# Altium project Power Distribution Board.PrjPcb
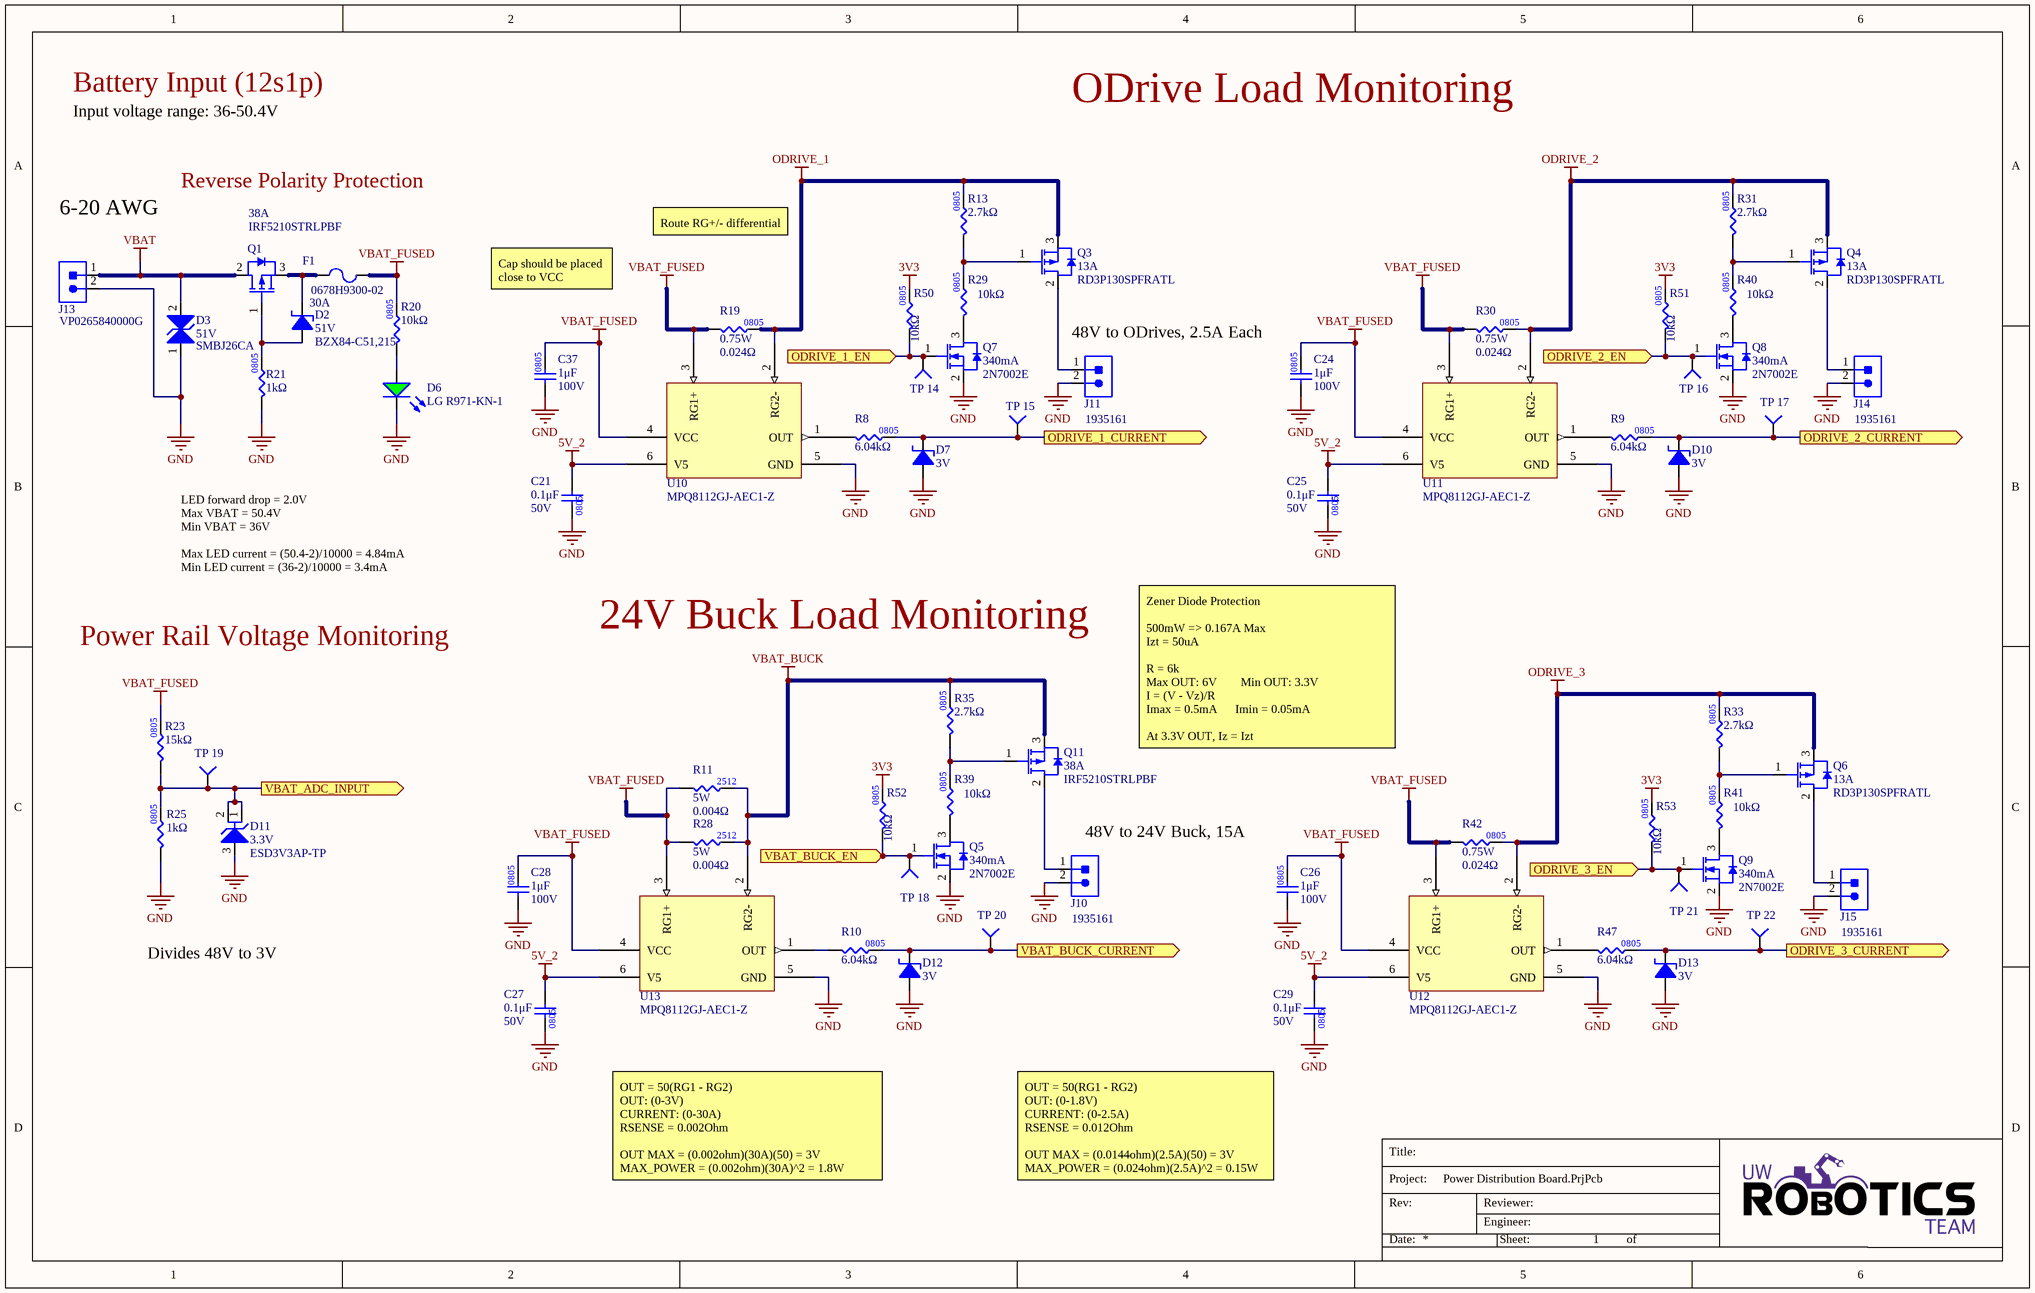
[diagram p0: SH1 - 48V POWER.SchDoc]
designer: Logan Hartford; reviewer: Ari Wasch; total sheets: 6; version: 6.0
5 sheets, 185 parts. Net scope: flat (ports and power ports of the same name join across sheets).
Board file: Power Distribution Board Rev6.PcbDoc
Sheets:
  SH1 - 48V POWER.SchDoc
  SH2 - 5V POWER.SchDoc
  SH3 - 17V POWER.SchDoc
  SH4 - 3.3V LINEAR REGULATOR.SchDoc
  SH5 - MICROCONTROLLER.SchDoc

## Sheet SH1 - 48V POWER.SchDoc: =documentname
size B; CheckedBy: Ari Wasch; Engineer: Logan Hartford; Organization: UW Robotics; Address1: 200 University Avenue; Address2: Waterloo; Address3: Ontario; Address4: Canada N2L 3G6; DocumentNumber: 1; Revision: 6.0; SheetNumber: 1; SheetTotal: 6

### Parts
C21  value 0.1μF  Voltage Rating: 50V  [CAP2012]  (hidden comment: CAP_0.1uF_50V_0805)
C24  value 1μF  Voltage Rating: 100V  [CAP0805]  (hidden comment: CAP_1uF_100V_0805)
C25  value 0.1μF  Voltage Rating: 50V  [CAP2012]  (hidden comment: CAP_0.1uF_50V_0805)
C26  value 1μF  Voltage Rating: 100V  [CAP0805]  (hidden comment: CAP_1uF_100V_0805)
C27  value 0.1μF  Voltage Rating: 50V  [CAP2012]  (hidden comment: CAP_0.1uF_50V_0805)
C28  value 1μF  Voltage Rating: 100V  [CAP0805]  (hidden comment: CAP_1uF_100V_0805)
C29  value 0.1μF  Voltage Rating: 50V  [CAP2012]  (hidden comment: CAP_0.1uF_50V_0805)
C37  value 1μF  Voltage Rating: 100V  [CAP0805]  (hidden comment: CAP_1uF_100V_0805)
D2  Manufacturer Part Number 1: BZX84-C51,215  Working Voltage: 51V  [SOT23-3]  (hidden comment: DIO_ZENER_51V)
D3  Manufacturer Part Number 1: SMBJ26CA  Voltage - Reverse Standoff (Typ): 51V  [TVS_DIODE_BIDIR_SMB]  (hidden comment: TVS_DIODE_BIDIR_51V)
D6  Manufacturer Part Number 1: LG R971-KN-1  [LED_0805_GREEN]  (hidden comment: LED_GREEN)
D7  Working Voltage: 3V  [MMSZ4683-TP]  (hidden comment: DIO_ZENER_3V)
D10  Working Voltage: 3V  [MMSZ4683-TP]  (hidden comment: DIO_ZENER_3V)
D11  Voltage - Reverse Standoff (Typ): 3.3V  [ESD3V3AP-TP]  (hidden comment: TVS_DIODE_3.3V_13.3A)
D12  Working Voltage: 3V  [MMSZ4683-TP]  (hidden comment: DIO_ZENER_3V)
D13  Working Voltage: 3V  [MMSZ4683-TP]  (hidden comment: DIO_ZENER_3V)
F1  Manufacturer Part Number 1: 0678H9300-02  Current Rating: 30A  [FUSE_3912]  (hidden comment: FUSE_30A_3912)
J10  CON_2M_TERM  [1935161]  (value not drawn)
J11  CON_2M_TERM  [1935161]  (value not drawn)
J13  CON_2POS_SCREW_TERM  [VP0265840000G]  (value not drawn)
J14  CON_2M_TERM  [1935161]  (value not drawn)
J15  CON_2M_TERM  [1935161]  (value not drawn)
Q1  Current - Continous Drain: 38A  Manufacturer Part Number 1: IRF5210STRLPBF  [DPAK254P1524X483-4_3N - new]  (hidden comment: PMOS_100V_38A)
Q3  Current - Continous Drain: 13A  [RD3P130SPFRATL]  (hidden comment: PMOS_100V_13A)
Q4  Current - Continous Drain: 13A  [RD3P130SPFRATL]  (hidden comment: PMOS_100V_13A)
Q5  Id: 340mA  Manufacturer Part Number 1: 2N7002E  [SOT23-3]  (hidden comment: NMOS_60V_340mS)
Q6  Current - Continous Drain: 13A  [RD3P130SPFRATL]  (hidden comment: PMOS_100V_13A)
Q7  Id: 340mA  Manufacturer Part Number 1: 2N7002E  [SOT23-3]  (hidden comment: NMOS_60V_340mS)
Q8  Id: 340mA  Manufacturer Part Number 1: 2N7002E  [SOT23-3]  (hidden comment: NMOS_60V_340mS)
Q9  Id: 340mA  Manufacturer Part Number 1: 2N7002E  [SOT23-3]  (hidden comment: NMOS_60V_340mS)
Q11  Current - Continous Drain: 38A  Manufacturer Part Number 1: IRF5210STRLPBF  [DPAK254P1524X483-4_3N - new]  (hidden comment: PMOS_100V_38A)
R8  value 6.04kΩ  [RES0805]  (hidden comment: RES_6.04kΩ_0805_1%)
R9  value 6.04kΩ  [RES0805]  (hidden comment: RES_6.04kΩ_0805_1%)
R10  value 6.04kΩ  [RES0805]  (hidden comment: RES_6.04kΩ_0805_1%)
R11  value 0.004Ω  Power: 5W  [RESC6532X75N]  (hidden comment: RES_4mΩ_2512_1%_5W)
R13  value 2.7kΩ  [RES0805]  (hidden comment: RES_2.7kΩ_0805_1%)
R19  value 0.024Ω  Power: 0.75W  [RES0805]  (hidden comment: RES_24mΩ_0805_1%)
R20  value 10kΩ  [RES0805]  (hidden comment: RES_10kΩ_0805_5%)
R21  value 1kΩ  [RES0805]  (hidden comment: RES_1kΩ_0805_1%)
R23  value 15kΩ  [RES0805]  (hidden comment: RES_15kΩ_0805_1%)
R25  value 1kΩ  [RES0805]  (hidden comment: RES_1kΩ_0805_1%_1)
R28  value 0.004Ω  Power: 5W  [RESC6532X75N]  (hidden comment: RES_4mΩ_2512_1%_5W)
R29  value 10kΩ  [RES0805]  (hidden comment: RES_10kΩ_0805_5%)
R30  value 0.024Ω  Power: 0.75W  [RES0805]  (hidden comment: RES_24mΩ_0805_1%)
R31  value 2.7kΩ  [RES0805]  (hidden comment: RES_2.7kΩ_0805_1%)
R33  value 2.7kΩ  [RES0805]  (hidden comment: RES_2.7kΩ_0805_1%)
R35  value 2.7kΩ  [RES0805]  (hidden comment: RES_2.7kΩ_0805_1%)
R39  value 10kΩ  [RES0805]  (hidden comment: RES_10kΩ_0805_5%)
R40  value 10kΩ  [RES0805]  (hidden comment: RES_10kΩ_0805_5%)
R41  value 10kΩ  [RES0805]  (hidden comment: RES_10kΩ_0805_5%)
R42  value 0.024Ω  Power: 0.75W  [RES0805]  (hidden comment: RES_24mΩ_0805_1%)
R47  value 6.04kΩ  [RES0805]  (hidden comment: RES_6.04kΩ_0805_1%)
R50  value 10kΩ  [RES0805]  (hidden comment: RES_10kΩ_0805_5%)
R51  value 10kΩ  [RES0805]  (hidden comment: RES_10kΩ_0805_5%)
R52  value 10kΩ  [RES0805]  (hidden comment: RES_10kΩ_0805_5%)
R53  value 10kΩ  [RES0805]  (hidden comment: RES_10kΩ_0805_5%)
TP_14  TESTPOINT_1MM_CIRCLE  [TESTPOINT_CIRCLE_1MM]  (value not drawn)  (no BOM)
TP_15  TESTPOINT_1MM_CIRCLE  [TESTPOINT_CIRCLE_1MM]  (value not drawn)  (no BOM)
TP_16  TESTPOINT_1MM_CIRCLE  [TESTPOINT_CIRCLE_1MM]  (value not drawn)  (no BOM)
TP_17  TESTPOINT_1MM_CIRCLE  [TESTPOINT_CIRCLE_1MM]  (value not drawn)  (no BOM)
TP_18  TESTPOINT_1MM_CIRCLE  [TESTPOINT_CIRCLE_1MM]  (value not drawn)  (no BOM)
TP_19  TESTPOINT_1MM_CIRCLE  [TESTPOINT_CIRCLE_1MM]  (value not drawn)  (no BOM)
TP_20  TESTPOINT_1MM_CIRCLE  [TESTPOINT_CIRCLE_1MM]  (value not drawn)  (no BOM)
TP_21  TESTPOINT_1MM_CIRCLE  [TESTPOINT_CIRCLE_1MM]  (value not drawn)  (no BOM)
TP_22  TESTPOINT_1MM_CIRCLE  [TESTPOINT_CIRCLE_1MM]  (value not drawn)  (no BOM)
U10  MPQ8112GJ-AEC1-Z  [MPQ8112GJ-AEC1-Z]
U11  MPQ8112GJ-AEC1-Z  [MPQ8112GJ-AEC1-Z]
U12  MPQ8112GJ-AEC1-Z  [MPQ8112GJ-AEC1-Z]
U13  MPQ8112GJ-AEC1-Z  [MPQ8112GJ-AEC1-Z]

### Ports
ODRIVE_1_CURRENT (out), ODRIVE_1_EN (in), ODRIVE_2_CURRENT (out), ODRIVE_2_EN (in), ODRIVE_3_CURRENT (out), ODRIVE_3_EN (in), VBAT_ADC_INPUT (out), VBAT_BUCK_CURRENT (out), VBAT_BUCK_EN (in)

### Nets
3V3: R50.2 R51.2 R52.2 R53.2
5V_2: C21.2 C25.2 C27.2 C29.2 U10.6(V5) U11.6(V5) U12.6(V5) U13.6(V5)
GND: C21.1 C24.1 C25.1 C26.1 C27.1 C28.1 C29.1 C37.1 D3.1 D6.2(K) D7.2(Anode) D10.2(Anode) D11.3 D12.2(Anode) D13.2(Anode) J10.2 J11.2 J13.2 J14.2 J15.2 Q5.2(Source) Q7.2(Source) Q8.2(Source) Q9.2(Source) R21.1 R25.1 U10.5(GND) U11.5(GND) U12.5(GND) U13.5(GND)
ODRIVE_1: Q3.3(Source) R13.2 R19.2 U10.2(RG2-)
ODRIVE_2: Q4.3(Source) R30.2 R31.2 U11.2(RG2-)
ODRIVE_3: Q6.3(Source) R33.2 R42.2 U12.2(RG2-)
VBAT: D3.2 J13.1 Q1.2(Drain)
VBAT_BUCK: Q11.3(Source) R11.2 R28.2 R35.2 U13.2(RG2-)
VBAT_FUSED: C24.2 C26.2 C28.2 C37.2 F1.2 R11.1 R19.1 R20.2 R23.2 R28.1 R30.1 R42.1 U10.3(RG1+) U10.4(VCC) U11.3(RG1+) U11.4(VCC) U12.3(RG1+) U12.4(VCC) U13.3(RG1+) U13.4(VCC)
ODRIVE_1_CURRENT: D7.1(Cathode) R8.2 TP_15.1(=value) ; port ODRIVE_1_CURRENT
ODRIVE_1_EN: Q7.1(Gate) R50.1 TP_14.1(=value) ; port ODRIVE_1_EN
ODRIVE_2_CURRENT: D10.1(Cathode) R9.2 TP_17.1(=value) ; port ODRIVE_2_CURRENT
ODRIVE_2_EN: Q8.1(Gate) R51.1 TP_16.1(=value) ; port ODRIVE_2_EN
ODRIVE_3_CURRENT: D13.1(Cathode) R47.2 TP_22.1(=value) ; port ODRIVE_3_CURRENT
ODRIVE_3_EN: Q9.1(Gate) R53.1 TP_21.1(=value) ; port ODRIVE_3_EN
VBAT_ADC_INPUT: D11.1 D11.2 R23.1 R25.2 TP_19.1(=value) ; port VBAT_ADC_INPUT
VBAT_BUCK_CURRENT: D12.1(Cathode) R10.2 TP_20.1(=value) ; port VBAT_BUCK_CURRENT
VBAT_BUCK_EN: Q5.1(Gate) R52.1 TP_18.1(=value) ; port VBAT_BUCK_EN
NetD2_1: D2.1(Anode) Q1.1(Gate) R21.2
NetD2_3: D2.3(Cathode) F1.1 Q1.3(Source)
NetD6_1: D6.1(A) R20.1
NetJ10_1: J10.1 Q11.2(Drain)
NetJ11_1: J11.1 Q3.2(Drain)
NetJ14_1: J14.1 Q4.2(Drain)
NetJ15_1: J15.1 Q6.2(Drain)
NetQ3_1: Q3.1(Gate) R13.1 R29.2
NetQ4_1: Q4.1(Gate) R31.1 R40.2
NetQ5_3: Q5.3(Drain) R39.1
NetQ6_1: Q6.1(Gate) R33.1 R41.2
NetQ7_3: Q7.3(Drain) R29.1
NetQ8_3: Q8.3(Drain) R40.1
NetQ9_3: Q9.3(Drain) R41.1
NetQ11_1: Q11.1(Gate) R35.1 R39.2
NetR8_1: R8.1 U10.1(OUT)
NetR9_1: R9.1 U11.1(OUT)
NetR10_1: R10.1 U13.1(OUT)
NetR47_1: R47.1 U12.1(OUT)

### Notes on the sheet
- Battery Input (12s1p)
- Input voltage range: 36-50.4V
- ODrive Load Monitoring
- 6-20 AWG
- Reverse Polarity Protection
- Route RG+/- differential
- Cap should be placed close to VCC
- 48V to ODrives, 2.5A Each
- LED forward drop = 2.0V
  Max VBAT = 50.4V
  Min VBAT = 36V
  Max LED current = (50.4-2)/10000 = 4.84mA
  Min LED current = (36-2)/10000 = 3.4mA
- 24V Buck Load Monitoring
- Power Rail Voltage Monitoring
- Zener Diode Protection
  500mW => 0.167A Max
  Izt = 50uA
  R = 6k
  Max OUT: 6V        Min OUT: 3.3V
  I = (V - Vz)/R
  Imax = 0.5mA      Imin = 0.05mA
  At 3.3V OUT, Iz = Izt
- 48V to 24V Buck, 15A
- Divides 48V to 3V
- OUT = 50(RG1 - RG2)
  OUT: (0-3V)
  CURRENT: (0-30A)
  RSENSE = 0.002Ohm
  OUT MAX = (0.002ohm)(30A)(50) = 3V
  MAX_POWER = (0.002ohm)(30A)^2 = 1.8W
- OUT = 50(RG1 - RG2)
  OUT: (0-1.8V)
  CURRENT: (0-2.5A)
  RSENSE = 0.012Ohm
  OUT MAX = (0.0144ohm)(2.5A)(50) = 3V
  MAX_POWER = (0.024ohm)(2.5A)^2 = 0.15W
- Title:
- Project:
- Date:
- Rev:
- Reviewer:
- Engineer:
- Sheet:
- of
- (in symbol RES_4mΩ_2512_1%_5W) 2512
- (in symbol RES_15kΩ_0805_1%) 0805

### Library data of the parts
C21 C25 C27 C29 = CAP_0.1uF_50V_0805: CAP CER 0.1UF 50V X7R 0805; Manufacturer Part Number 1: GCM21BR71H104KA37K; Manufacturer 1: Murata Electronics; Package/Footprint: 0805; Supplier Part Number 1: 490-8049-1-ND; Supplier 1: Digi-Key; Dielectric: X7R; LCSC Part #: C49678; Mounting Type: SMD
C24 C26 C28 C37 = CAP_1uF_100V_0805: CAP CER 1UF 100V X7S 0805; Supplier 1: Digi-Key; Mounting Type: SMD; Package: 0805; Supplier Part Number 1: 490-14464-1-ND
D2 = DIO_ZENER_51V: DIODE ZENER 51V 250MW TO236AB; Manufacturer 1: Nexperia USA Inc.; Forward Voltage: 0.9V; Supplier Part Number 1: 1727-5037-1-ND; Supplier 1: Digi-Key; Package/Case: SOT-23-3
D3 = TVS_DIODE_BIDIR_51V: TVS DIODE 51VWM 82.4VC DO214AA; Manufacturer 1: Littelfuse; Package/Footprint: SMB; Voltage - Clamping (Max) @ Ipp: 82.4V; Voltage - Breakdown (Min): 56.7V; Mounting Type: SMD; Supplier 1: Digi-Key; Supplier Part Number 1: SMBJ51CALFCT-ND; Supplier 2: Digi-Key; Supplier Part Number 2: SMBJ51CA-FDIDKR-ND
D6 = LED_GREEN: LED GREEN DIFFUSED 0805 SMD; Manufacturer 1: OSRAM; Forward Voltage Drop: 2.2V; Package/Footprint: 0805; Mounting Type: SMD; Supplier 1: Digi-Key; Supplier Part Number 1: 475-1410-1-ND; Supplier 2: Future Electronics; Supplier Part Number 2: 1152237
D7 D10 D12 D13 = DIO_ZENER_3V: DIODE ZENER 3V 500MW SOD123; Manufacturer 1: Micro Commercial Co; Forward Voltage: 0.95V; Manufacturer Part Number 1: MMSZ4683-TP; Supplier Part Number 1: MMSZ4683-TPMSCT-ND; Supplier 1: Digi-Key; Package/Case: SOD-123
D11 = TVS_DIODE_3.3V_13.3A: TVS DIODE 3.3VWM 7.5VC SOT23; Manufacturer 1: Micro Commercial Co; Package/Footprint: SOT-23; Voltage - Breakdown (Min): 5V; Voltage - Clamping (Max) @ Ipp: 7.5V; Mounting Type: SMD; Supplier 1: Digi-Key; Supplier Part Number 1: ESD3V3AP-TPMSCT-ND; Manufacturer Part Number 1: ESD3V3AP-TP
F1 = FUSE_30A_3912: FUSE SMT 3912 ENH BRK 250V 30A; Manufacturer 1: Bel Fuse Inc.; Package/Footprint: 3912; Supplier 1: Digi-Key; Supplier Part Number 1: 507-2254-1-ND; Mounting Type: SMD; Verified: No
J10 J11 J14 J15 = CON_2M_TERM: TERM BLK 2POS SIDE ENTRY 5MM; Manufacturer 1: Phoenix Contact; Max Current Rating: 16A; Current: 18A; Voltage: 300V; Package/Footprint: SMD; Supplier 1: Digi-Key; Supplier Part Number 1: 277-1667-ND; Manufacturer Part Number 1: 1935161; Mounting Type: TH
J13 = CON_2POS_SCREW_TERM_65A: PCB TERMINAL BLOCKS RISING CLAMP; Manufacturer 1: Amphenol Anytek; Supplier 1: Digi-Key; Mounting Type: TH; Package/Footprint: TERMINAL; Supplier Part Number 1: 1818-VP0265840000G-ND; Manufacturer Part Number 1: VP0265840000G
Q1 Q11 = PMOS_100V_38A: MOSFET P-CH 100V 38A D2PAK; Manufacturer 1: Vishay Siliconix; Vgs (Max): ±15V; Id: 120A; Mounting Type: SMD; Verified: No; Vdss: 100V; Supplier 1: Digi-Key; Supplier Part Number 1: IRF5210STRLPBFCT-ND; Package/Footprint: D2Pak
Q3 Q4 Q6 = PMOS_100V_13A: MOSFET P-CH 100V 13A TO252; Manufacturer 1: Rohm Semiconductor; Vgs (Max): ±20V; Package/Footprint: D2Pak; Mounting Type: SMD; Verified: No; Vdss: 100V; Supplier 1: Digi-Key; Supplier Part Number 1: RD3P130SPFRATLCT-ND; Manufacturer Part Number 1: RD3P130SPFRATL
Q5 Q7-Q9 = NMOS_60V_340mS: N-Channel 60 V 340mA (Ta) 350mW (Ta) Surface Mount SOT-23; Manufacturer 1: ANBON SEMICONDUCTOR (INT'L) LIMITED; Vgs (Max): ±20V; Vdss: 60V; Supplier 1: Digi-Key; Supplier Part Number 1: 4530-2N7002ECT-ND; Mounting Type: SMD; Package/Footprint: SOT-23; Verified: No
R8-R10 R47 = RES_6.04kΩ_0805_1%: RES 6.04K OHM 1% 1/8W 0805; Manufacturer 1: Yageo; Manufacturer Part Number 1: RC0805FR-076K04L; Package/Footprint: 0805; Mounting Type: SMD; Supplier 1: Digi-Key; Supplier Part Number 1: 311-6.04KCRCT-ND
R11 R28 = RES_4mΩ_2512_1%_5W: RES 4M OHM 1% 5W 2512; Manufacturer 1: KOA Speer Electronics, Inc.; Manufacturer Part Number 1: TLR3APDTE4L00F75; Supplier 1: Digi-Key; Supplier Part Number 1: 2019-TLR3APDTE4L00F75CT-ND
R13 R31 R33 R35 = RES_2.7kΩ_0805_1%: RES 2.7K OHM 1% 1/8W 0805; Manufacturer 1: Panasonic Electronic Components; Manufacturer Part Number 1: ERJ-6ENF2701V; Supplier 1: Digi-Key; Supplier Part Number 1: P2.70KCCT-ND; Mounting Type: SMD; LCSC Part #: C17530; Package: 0805
R19 R30 R42 = RES_24mΩ_0805_1%: RES 0.024 OHM 1% 3/4W 0805; Manufacturer 1: Thin Film Technology Corp.; Manufacturer Part Number 1: D1WEL0805MR024F-T5; Supplier 1: Digi-Key; Supplier Part Number 1: 4463-D1WEL0805MR024F-T5CT-ND; Package: 0805
R20 R29 R39-R41 R50-R53 = RES_10kΩ_0805_5%: RES 10K OHM 5% 1/8W 0805; Manufacturer 1: Panasonic Electronic Components; Manufacturer Part Number 1: ERJ-6GEYJ103V; Package/Footprint: 0805; Supplier Part Number 1: P10KACT-ND; Supplier 1: Digi-Key; LCSC Part #: C17414; Mounting Type: SMD
R21 = RES_1kΩ_0805_1%: RES 1K OHM 1% 1/8W 0805; Manufacturer 1: Yageo; Manufacturer Part Number 1: RC0805FR-071KL; Package: 0805; Supplier Part Number 1: 311-1.00KCRCT-ND; Supplier 1: Digi-Key; Mounting Type: SMD; LCSC Part #: C17513
R23 = RES_15kΩ_0805_1%: RES 15K OHM 1% 1/8W 0805 /; Manufacturer 1: Vishay Dale; Manufacturer Part Number 1: CRCW080515K0FKEA; Supplier Part Number 1: 541-15.0KCCT-ND; Supplier 1: Digi-Key
R25 = RES_1kΩ_0805_1%_1: RES 1K OHM 1% 1/8W 0805; Manufacturer 1: Yageo; Manufacturer Part Number 1: RC0805FR-071KL; Supplier 1: Digi-Key; Supplier Part Number 1: 311-1.00KCRCT-ND; Package: 0805; Mounting Type: SMD; LCSC Part #: C17513
TP_14-TP_22 = TESTPOINT_1MM_CIRCLE: TESTPOINT 1MM CIRCLE
U10-U13 = MPQ8112GJ-AEC1-Z: 60V, HIGH-SIDE CURRENT-SENSE AMP; Manufacturer: Monolithic Power Systems Inc.; Vmin: 2.7V; Gain: 50; Supplier: Digi-Key; Supplier Part Number: 1589-MPQ8112GJ-AEC1-ZCT-ND; Vmax: 60V; Supplier 1: Digi-Key; Supplier Part Number 1: 1589-MPQ8112GJ-AEC1-ZCT-ND; Manufacturer Part Number: MPQ8112GJ-AEC1-Z

## Sheet SH2 - 5V POWER.SchDoc: =documentname
size B; CheckedBy: Ari Wasch; Engineer: Logan Hartford; Organization: UW Robotics; Address1: 200 University Avenue; Address2: Waterloo; Address3: Ontario; Address4: Canada N2L 3G6; DocumentNumber: 5; Revision: 6.0; SheetNumber: 2; SheetTotal: 6
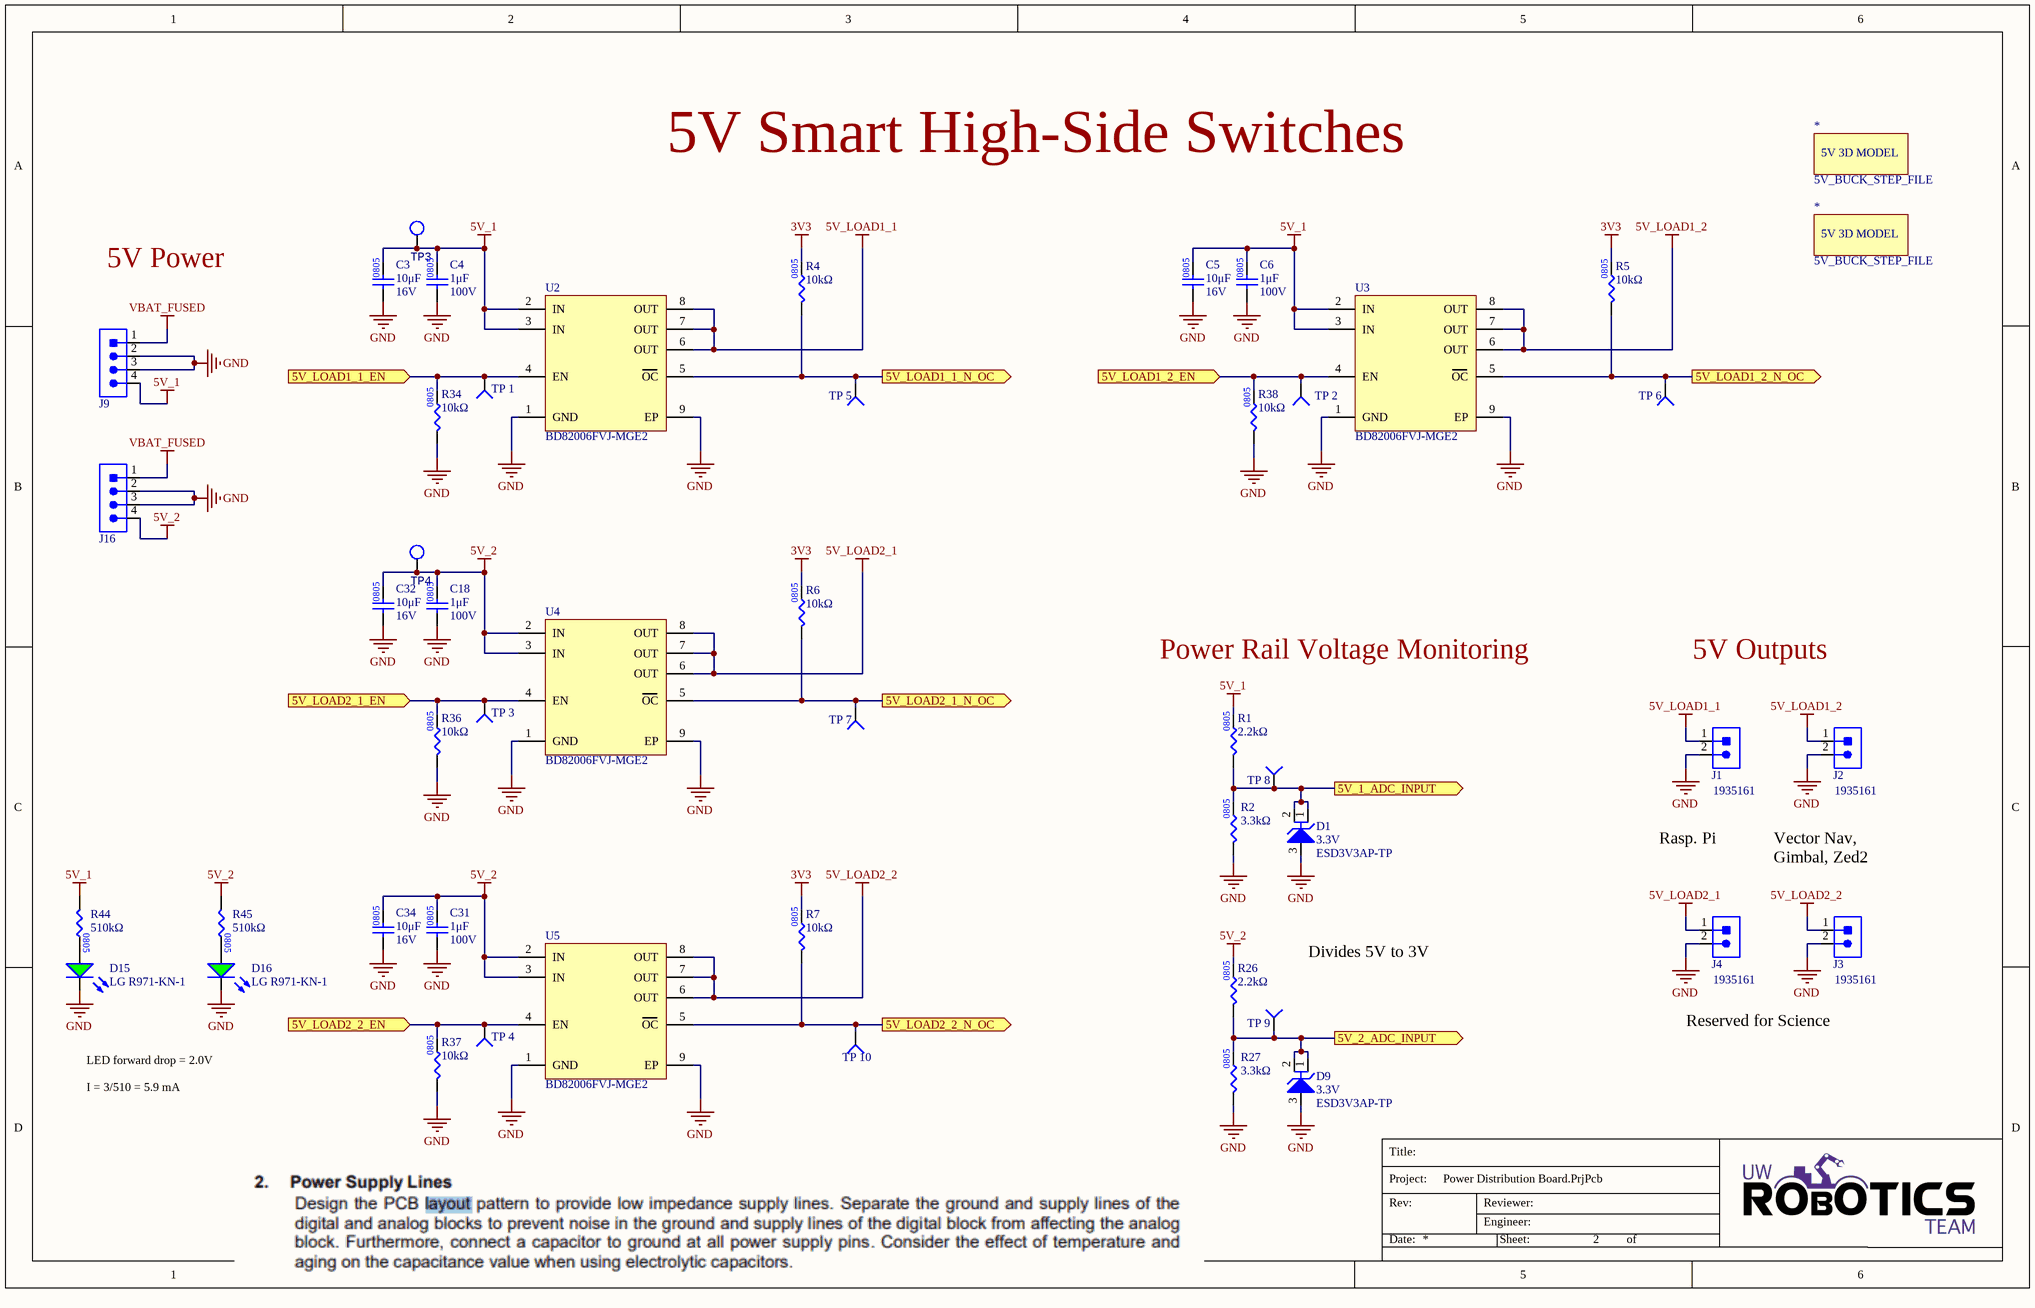
[diagram p1: SH2 - 5V POWER.SchDoc]

### Parts
(Parts that share a designator on the sheet are numbered #1, #2 ... from top to bottom, then left to right.)
*#1  5V_BUCK_STEP_FILE  [5V_BUCK_3D_MODEL]
*#2  5V_BUCK_STEP_FILE  [5V_BUCK_3D_MODEL]
C3  value 10μF  Voltage Rating: 16V  [CAP0805]  (hidden comment: CAP_10uF_16V_0805)
C4  value 1μF  Voltage Rating: 100V  [CAP0805]  (hidden comment: CAP_1uF_100V_0805)
C5  value 10μF  Voltage Rating: 16V  [CAP0805]  (hidden comment: CAP_10uF_16V_0805)
C6  value 1μF  Voltage Rating: 100V  [CAP0805]  (hidden comment: CAP_1uF_100V_0805)
C18  value 1μF  Voltage Rating: 100V  [CAP0805]  (hidden comment: CAP_1uF_100V_0805)
C31  value 1μF  Voltage Rating: 100V  [CAP0805]  (hidden comment: CAP_1uF_100V_0805)
C32  value 10μF  Voltage Rating: 16V  [CAP0805]  (hidden comment: CAP_10uF_16V_0805)
C34  value 10μF  Voltage Rating: 16V  [CAP0805]  (hidden comment: CAP_10uF_16V_0805)
D1  Voltage - Reverse Standoff (Typ): 3.3V  [ESD3V3AP-TP]  (hidden comment: TVS_DIODE_3.3V_13.3A)
D9  Voltage - Reverse Standoff (Typ): 3.3V  [ESD3V3AP-TP]  (hidden comment: TVS_DIODE_3.3V_13.3A)
D15  Manufacturer Part Number 1: LG R971-KN-1  [LED_0805_GREEN]  (hidden comment: LED_GREEN)
D16  Manufacturer Part Number 1: LG R971-KN-1  [LED_0805_GREEN]  (hidden comment: LED_GREEN)
J1  CON_2M_TERM  [1935161]  (value not drawn)
J2  CON_2M_TERM  [1935161]  (value not drawn)
J3  CON_2M_TERM  [1935161]  (value not drawn)
J4  CON_2M_TERM  [1935161]  (value not drawn)
J9  CON_2POS_SCREW_TERM  [MPS-04-7.70-01-L-V]  (value not drawn)
J16  CON_2POS_SCREW_TERM  [MPS-04-7.70-01-L-V]  (value not drawn)
R1  value 2.2kΩ  [RES0805]  (hidden comment: RES_2.2kΩ_0805)
R2  value 3.3kΩ  [RES0805]  (hidden comment: RES_3.3kΩ_0805_1%)
R4  value 10kΩ  [RES0805]  (hidden comment: RES_10kΩ_0805_5%)
R5  value 10kΩ  [RES0805]  (hidden comment: RES_10kΩ_0805_5%)
R6  value 10kΩ  [RES0805]  (hidden comment: RES_10kΩ_0805_5%)
R7  value 10kΩ  [RES0805]  (hidden comment: RES_10kΩ_0805_5%)
R26  value 2.2kΩ  [RES0805]  (hidden comment: RES_2.2kΩ_0805)
R27  value 3.3kΩ  [RES0805]  (hidden comment: RES_3.3kΩ_0805_1%)
R34  value 10kΩ  [RES0805]  (hidden comment: RES_10kΩ_0805_5%)
R36  value 10kΩ  [RES0805]  (hidden comment: RES_10kΩ_0805_5%)
R37  value 10kΩ  [RES0805]  (hidden comment: RES_10kΩ_0805_5%)
R38  value 10kΩ  [RES0805]  (hidden comment: RES_10kΩ_0805_5%)
R44  value 510kΩ  [RES0805]  (hidden comment: RES_510kΩ_0805_1%)
R45  value 510kΩ  [RES0805]  (hidden comment: RES_510kΩ_0805_1%)
TP3  TESTPOINT_LOOP  [TESTPOINT_LOOP]  (value not drawn)
TP4  TESTPOINT_LOOP  [TESTPOINT_LOOP]  (value not drawn)
TP_1  TESTPOINT_1MM_CIRCLE  [TESTPOINT_CIRCLE_1MM]  (value not drawn)  (no BOM)
TP_2  TESTPOINT_1MM_CIRCLE  [TESTPOINT_CIRCLE_1MM]  (value not drawn)  (no BOM)
TP_3  TESTPOINT_1MM_CIRCLE  [TESTPOINT_CIRCLE_1MM]  (value not drawn)  (no BOM)
TP_4  TESTPOINT_1MM_CIRCLE  [TESTPOINT_CIRCLE_1MM]  (value not drawn)  (no BOM)
TP_5  TESTPOINT_1MM_CIRCLE  [TESTPOINT_CIRCLE_1MM]  (value not drawn)  (no BOM)
TP_6  TESTPOINT_1MM_CIRCLE  [TESTPOINT_CIRCLE_1MM]  (value not drawn)  (no BOM)
TP_7  TESTPOINT_1MM_CIRCLE  [TESTPOINT_CIRCLE_1MM]  (value not drawn)  (no BOM)
TP_8  TESTPOINT_1MM_CIRCLE  [TESTPOINT_CIRCLE_1MM]  (value not drawn)  (no BOM)
TP_9  TESTPOINT_1MM_CIRCLE  [TESTPOINT_CIRCLE_1MM]  (value not drawn)  (no BOM)
TP_10  TESTPOINT_1MM_CIRCLE  [TESTPOINT_CIRCLE_1MM]  (value not drawn)  (no BOM)
U2  BD82006FVJ-MGE2  [8-TSSOP-BJ]
U3  BD82006FVJ-MGE2  [8-TSSOP-BJ]
U4  BD82006FVJ-MGE2  [8-TSSOP-BJ]
U5  BD82006FVJ-MGE2  [8-TSSOP-BJ]

### Ports
5V_1_ADC_INPUT (out), 5V_2_ADC_INPUT (out), 5V_LOAD1_1_EN (in), 5V_LOAD1_1_N_OC (out), 5V_LOAD1_2_EN (in), 5V_LOAD1_2_N_OC (out), 5V_LOAD2_1_EN (in), 5V_LOAD2_1_N_OC (out), 5V_LOAD2_2_EN (in), 5V_LOAD2_2_N_OC (out)

### Nets
3V3: R4.2 R5.2 R6.2 R7.2
5V_1: C3.2 C4.2 C5.2 C6.2 J9.4 R1.2 R44.1 TP3.1 U2.2(IN) U2.3(IN) U3.2(IN) U3.3(IN)
5V_2: C18.2 C31.2 C32.2 C34.2 J16.4 R26.2 R45.1 TP4.1 U4.2(IN) U4.3(IN) U5.2(IN) U5.3(IN)
5V_LOAD1_1: J1.1 U2.6(OUT) U2.7(OUT) U2.8(OUT)
5V_LOAD1_2: J2.1 U3.6(OUT) U3.7(OUT) U3.8(OUT)
5V_LOAD2_1: J4.1 U4.6(OUT) U4.7(OUT) U4.8(OUT)
5V_LOAD2_2: J3.1 U5.6(OUT) U5.7(OUT) U5.8(OUT)
GND: C3.1 C4.1 C5.1 C6.1 C18.1 C31.1 C32.1 C34.1 D1.3 D9.3 D15.2(K) D16.2(K) J1.2 J2.2 J3.2 J4.2 J9.2 J9.3 J16.2 J16.3 R2.1 R27.1 R34.1 R36.1 R37.1 R38.1 U2.1(GND) U2.9(EP) U3.1(GND) U3.9(EP) U4.1(GND) U4.9(EP) U5.1(GND) U5.9(EP)
VBAT_FUSED: J9.1 J16.1
5V_1_ADC_INPUT: D1.1 D1.2 R1.1 R2.2 TP_8.1(=value) ; port 5V_1_ADC_INPUT
5V_2_ADC_INPUT: D9.1 D9.2 R26.1 R27.2 TP_9.1(=value) ; port 5V_2_ADC_INPUT
5V_lOAD1_1_EN: R34.2 TP_1.1(=value) U2.4(EN) ; port 5V_LOAD1_1_EN
5V_lOAD1_1_N_OC: R4.1 TP_5.1(=value) U2.5(OC) ; port 5V_LOAD1_1_N_OC
5V_lOAD1_2_EN: R38.2 TP_2.1(=value) U3.4(EN) ; port 5V_LOAD1_2_EN
5V_lOAD1_2_N_OC: R5.1 TP_6.1(=value) U3.5(OC) ; port 5V_LOAD1_2_N_OC
5V_lOAD2_1_EN: R36.2 TP_3.1(=value) U4.4(EN) ; port 5V_LOAD2_1_EN
5V_lOAD2_1_N_OC: R6.1 TP_7.1(=value) U4.5(OC) ; port 5V_LOAD2_1_N_OC
5V_lOAD2_2_EN: R37.2 TP_4.1(=value) U5.4(EN) ; port 5V_LOAD2_2_EN
5V_lOAD2_2_N_OC: R7.1 TP_10.1(=value) U5.5(OC) ; port 5V_LOAD2_2_N_OC
NetD15_1: D15.1(A) R44.2
NetD16_1: D16.1(A) R45.2

### Notes on the sheet
- 5V Smart High-Side Switches
- 5V Power
- Power Rail Voltage Monitoring
- 5V Outputs
- Rasp. Pi
- Vector Nav, Gimbal, Zed2
- Divides 5V to 3V
- Reserved for Science
- LED forward drop = 2.0V
  I = 3/510 = 5.9 mA
- Title:
- Project:
- Date:
- Rev:
- Reviewer:
- Engineer:
- Sheet:
- of
- (in symbol 5V_BUCK_STEP_FILE) 5V 3D MODEL

### Library data of the parts
C3 C5 C32 C34 = CAP_10uF_16V_0805: CAP CER 10UF 16V X5R 0805; Manufacturer 1: Yageo; Manufacturer Part Number 1: CC0805KKX5R7BB106; Package/Footprint: 0805; Mounting Type: SMD; Supplier 1: Digi-Key; Supplier Part Number 1: 311-1865-1-ND; Dielectric: X5R
C4 C6 C18 C31 = CAP_1uF_100V_0805: CAP CER 1UF 100V X7S 0805; Supplier 1: Digi-Key; Mounting Type: SMD; Package: 0805; Supplier Part Number 1: 490-14464-1-ND
D1 D9 = TVS_DIODE_3.3V_13.3A: as D11 on sheet SH1 - 48V POWER; Mounting Type: SMD; Supplier 1: Digi-Key; Supplier Part Number 1: ESD3V3AP-TPMSCT-ND; Manufacturer Part Number 1: ESD3V3AP-TP
D15 D16 = LED_GREEN: as D6 on sheet SH1 - 48V POWER; Mounting Type: SMD; Supplier 1: Digi-Key; Supplier Part Number 1: 475-1410-1-ND; Supplier 2: Future Electronics; Supplier Part Number 2: 1152237
J1-J4 = CON_2M_TERM: as J10 on sheet SH1 - 48V POWER; Supplier 1: Digi-Key; Supplier Part Number 1: 277-1667-ND; Manufacturer Part Number 1: 1935161; Mounting Type: TH
J9 J16 = CON_4POS_POWERBLADE_FEM: VERTICAL MINI-POWER SKT; Manufacturer 1: Samtec Inc.; Package/Footprint: PowerStrip™ 30 MPS; Supplier 1: Digi-Key; Mounting Type: TH; Supplier Part Number 1: SAM9721-ND; Manufacturer Part Number 1: MPS-04-7.70-01-L-V
R1 R26 = RES_2.2kΩ_0805_5%: RES 2.2K OHM 5% 1/8W 0805; Manufacturer 1: TE Connectivity Passive Product; Manufacturer Part Number 1: CRG0805F2K2; Tolerance: 1%; Supplier Part Number 1: A106060CT-ND; Supplier 1: Digi-Key; Package: 0805
R2 R27 = RES_3.3kΩ_0805_1%: RES 3.3K OHM 1% 1/8W 0805; Manufacturer 1: Vishay Dale; Manufacturer Part Number 1: CRCW06033K30FKEA; Supplier 1: Digi-Key; Supplier Part Number 1: 541-3.30KHCT-ND; LCSC Part #: C26010; Mounting Type: SMD; Package: 0805
R4-R7 R34 R36-R38 = RES_10kΩ_0805_5%: as R20 on sheet SH1 - 48V POWER; Supplier 1: Digi-Key; Supplier Part Number 1: P10KACT-ND; LCSC Part #: C17414; Mounting Type: SMD
R44 R45 = RES_510kΩ_0805_1%: RES 510K OHM 5% 1/8W 0805; Manufacturer 1: Stackpole Electronics Inc; Manufacturer Part Number 1: RMCF0805JT510K; Package/Footprint: 0805; Mounting Type: SMD; Supplier 1: Digi-Key; Supplier Part Number 1: RMCF0805JT510KCT-ND
TP3 TP4 = TESTPOINT_LOOP: TESTPOINT THRUHOLE; Manufacturer 1: Keystone Electronics; Manufacturer Part Number 1: 5002; Package/Footprint: TH; Supplier Part Number 1: 36-5002-ND; Supplier 1: Digi-Key; Mounting Type: TH
TP_1-TP_10 = TESTPOINT_1MM_CIRCLE: TESTPOINT 1MM CIRCLE
U2-U5 = BD82006FVJ-MGE2: IC PWR SWITCH N-CHAN 1:1 8TSSOP; Manufacturer 1: Rohm Semiconductor; Package/Footprint: 8-TSSOP; Rds On (Typ): 70mOhm; Mounting Type: SMD; Supplier 1: Digi-Key; Supplier Part Number 1: BD82006FVJ-MGE2CT-ND; Manufacturer Part Number 1: BD82006FVJ-MGE2

## Sheet SH3 - 17V POWER.SchDoc: =documentname
size B; CheckedBy: Ari Wasch; DrawnBy: Farris Matar; Engineer: Logan Hartford; Organization: UW Robotics; Address1: 200 University Avenue; Address2: Waterloo; Address3: Ontario; Address4: Canada N2L 3G6; DocumentNumber: 6; Revision: 6.0; SheetNumber: 3; SheetTotal: 6
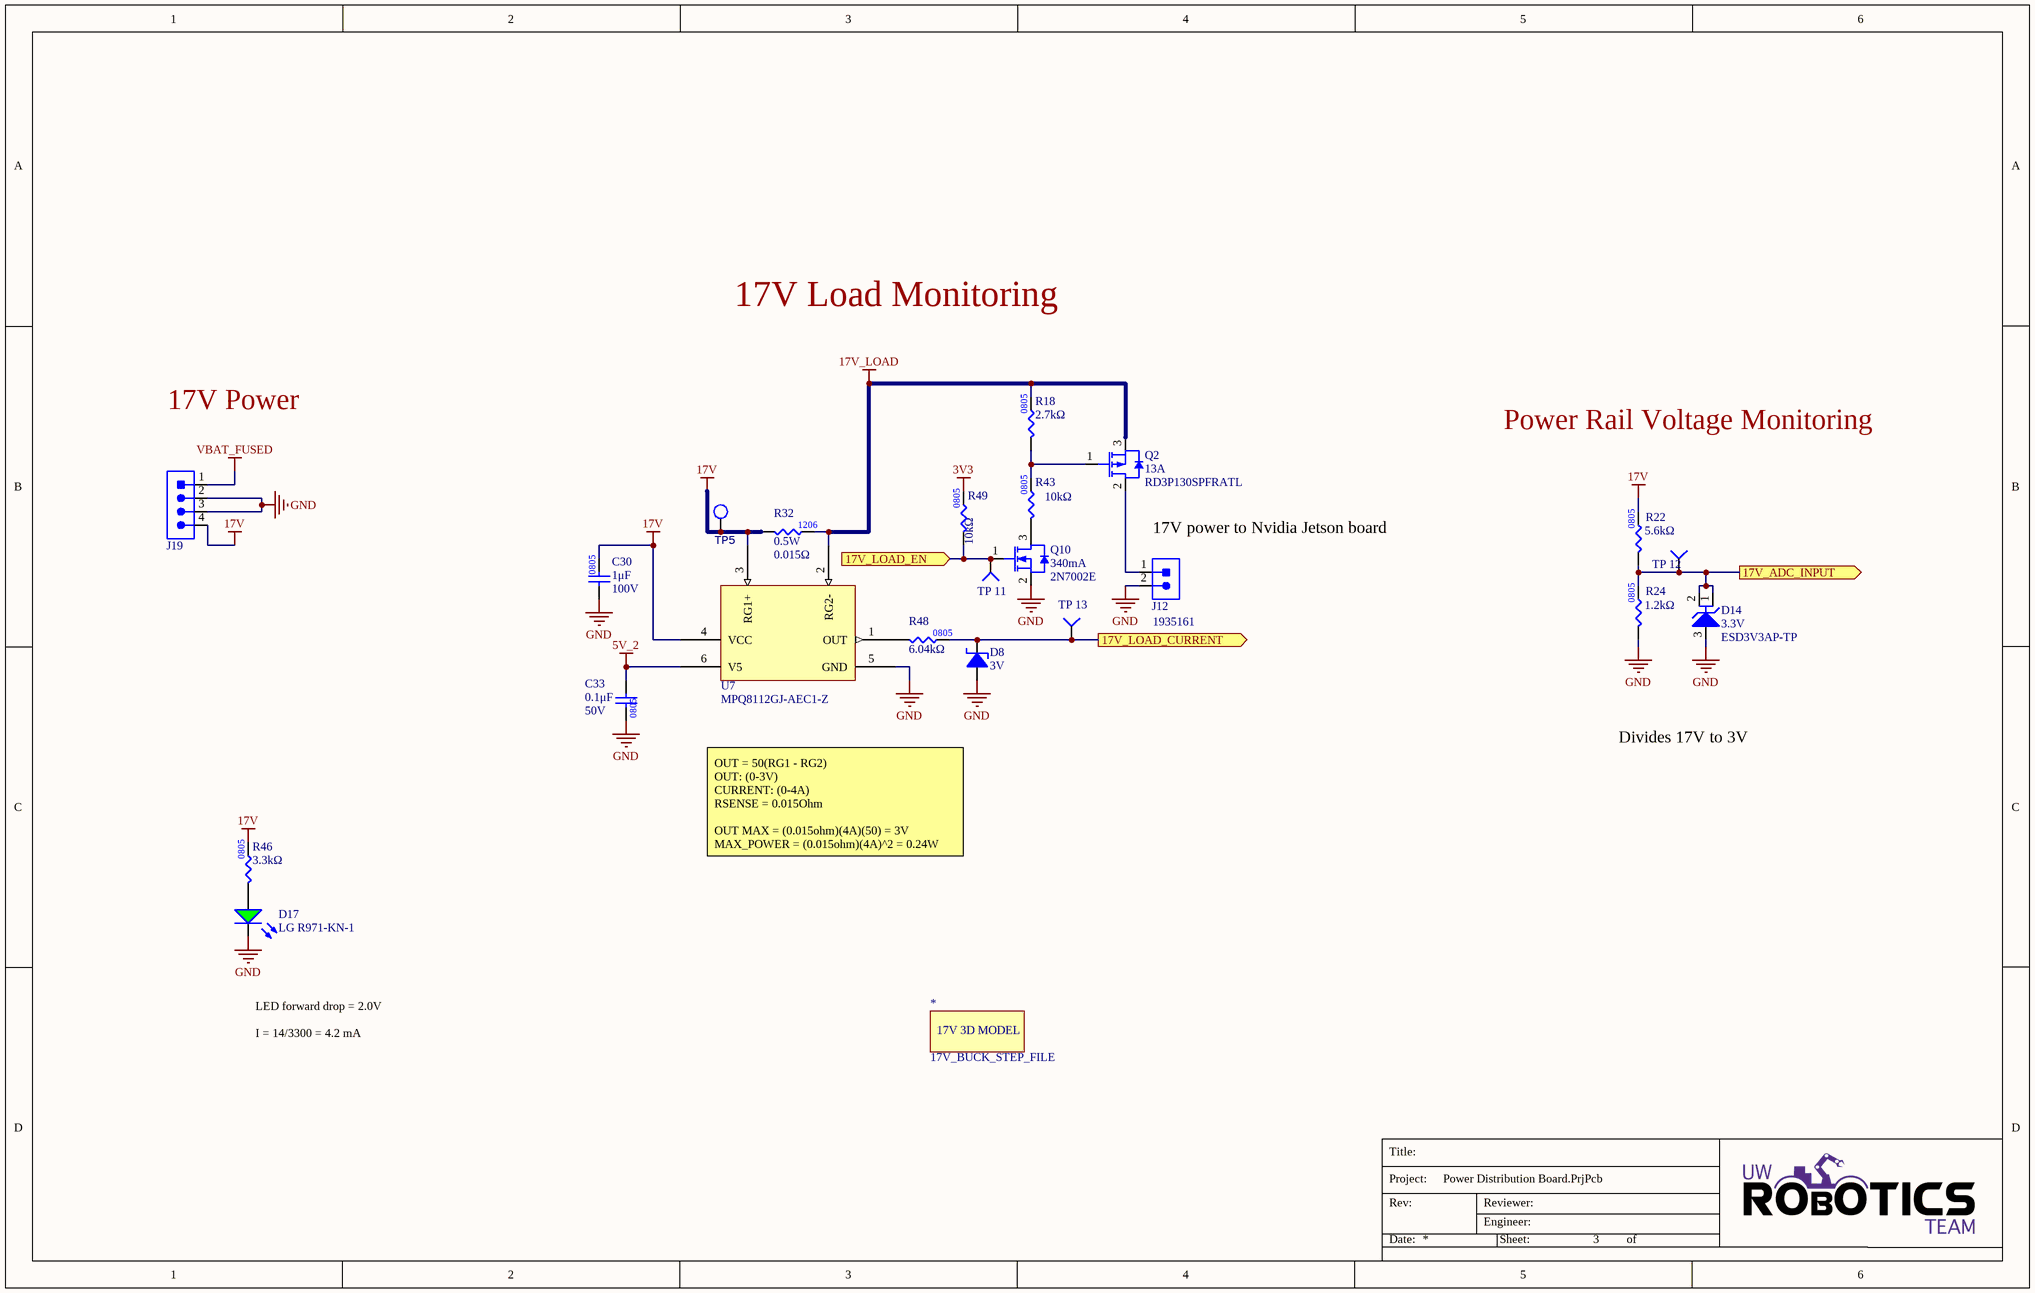
[diagram p2: SH3 - 17V POWER.SchDoc]

### Parts
(Parts that share a designator on the sheet are numbered #1, #2 ... from top to bottom, then left to right.)
*#3  17V_BUCK_STEP_FILE  [17V_3D_MODEL]
C30  value 1μF  Voltage Rating: 100V  [CAP0805]  (hidden comment: CAP_1uF_100V_0805)
C33  value 0.1μF  Voltage Rating: 50V  [CAP2012]  (hidden comment: CAP_0.1uF_50V_0805)
D8  Working Voltage: 3V  [MMSZ4683-TP]  (hidden comment: DIO_ZENER_3V)
D14  Voltage - Reverse Standoff (Typ): 3.3V  [ESD3V3AP-TP]  (hidden comment: TVS_DIODE_3.3V_13.3A)
D17  Manufacturer Part Number 1: LG R971-KN-1  [LED_0805_GREEN]  (hidden comment: LED_GREEN)
J12  CON_2M_TERM  [1935161]  (value not drawn)
J19  CON_2POS_SCREW_TERM  [MPS-04-7.70-01-L-V]  (value not drawn)
Q2  Current - Continous Drain: 13A  [RD3P130SPFRATL]  (hidden comment: PMOS_100V_13A)
Q10  Id: 340mA  Manufacturer Part Number 1: 2N7002E  [SOT23-3]  (hidden comment: NMOS_60V_340mS)
R18  value 2.7kΩ  [RES0805]  (hidden comment: RES_2.7kΩ_0805_1%)
R22  value 5.6kΩ  [RES0805]  (hidden comment: RES_5.6kΩ_0805)
R24  value 1.2kΩ  [RES0805]  (hidden comment: RES_1.2kΩ_0805)
R32  value 0.015Ω  Power: 0.5W  [RES1206]  (hidden comment: RES_0.015Ω_1206_1%)
R43  value 10kΩ  [RES0805]  (hidden comment: RES_10kΩ_0805_5%)
R46  value 3.3kΩ  [RES0805]  (hidden comment: RES_3.3kΩ_0805_1%)
R48  value 6.04kΩ  [RES0805]  (hidden comment: RES_6.04kΩ_0805_1%)
R49  value 10kΩ  [RES0805]  (hidden comment: RES_10kΩ_0805_5%)
TP5  TESTPOINT_LOOP  [TESTPOINT_LOOP]  (value not drawn)
TP_11  TESTPOINT_1MM_CIRCLE  [TESTPOINT_CIRCLE_1MM]  (value not drawn)  (no BOM)
TP_12  TESTPOINT_1MM_CIRCLE  [TESTPOINT_CIRCLE_1MM]  (value not drawn)  (no BOM)
TP_13  TESTPOINT_1MM_CIRCLE  [TESTPOINT_CIRCLE_1MM]  (value not drawn)  (no BOM)
U7  MPQ8112GJ-AEC1-Z  [MPQ8112GJ-AEC1-Z]

### Ports
17V_ADC_INPUT (out), 17V_LOAD_CURRENT (out), 17V_LOAD_EN (in)

### Nets
3V3: R49.2
5V_2: C33.2 U7.6(V5)
17V: C30.2 J19.4 R22.2 R32.1 R46.2 TP5.1 U7.3(RG1+) U7.4(VCC)
17V_LOAD: Q2.3(Source) R18.2 R32.2 U7.2(RG2-)
GND: C30.1 C33.1 D8.2(Anode) D14.3 D17.2(K) J12.2 J19.2 J19.3 Q10.2(Source) R24.1 U7.5(GND)
VBAT_FUSED: J19.1
17V_ADC_INPUT: D14.1 D14.2 R22.1 R24.2 TP_12.1(=value) ; port 17V_ADC_INPUT
17V_LOAD_CURRENT: D8.1(Cathode) R48.2 TP_13.1(=value) ; port 17V_LOAD_CURRENT
17V_LOAD_EN: Q10.1(Gate) R49.1 TP_11.1(=value) ; port 17V_LOAD_EN
NetD17_1: D17.1(A) R46.1
NetJ12_1: J12.1 Q2.2(Drain)
NetQ2_1: Q2.1(Gate) R18.1 R43.2
NetQ10_3: Q10.3(Drain) R43.1
NetR48_1: R48.1 U7.1(OUT)

### Notes on the sheet
- 17V Load Monitoring
- 17V Power
- Power Rail Voltage Monitoring
- (near J12) 17V power to Nvidia Jetson board
- Divides 17V to 3V
- OUT = 50(RG1 - RG2)
  OUT: (0-3V)
  CURRENT: (0-4A)
  RSENSE = 0.015Ohm
  OUT MAX = (0.015ohm)(4A)(50) = 3V
  MAX_POWER = (0.015ohm)(4A)^2 = 0.24W
- LED forward drop = 2.0V
  I = 14/3300 = 4.2 mA
- Title:
- Project:
- Date:
- Rev:
- Reviewer:
- Engineer:
- Sheet:
- of
- (in symbol 17V_BUCK_STEP_FILE) 17V 3D MODEL
- (in symbol RES_0.015Ω_1206_1%) 1206

### Library data of the parts
C30 = CAP_1uF_100V_0805: CAP CER 1UF 100V X7S 0805; Supplier 1: Digi-Key; Mounting Type: SMD; Package: 0805; Supplier Part Number 1: 490-14464-1-ND
C33 = CAP_0.1uF_50V_0805: as C21 on sheet SH1 - 48V POWER; Supplier Part Number 1: 490-8049-1-ND; Supplier 1: Digi-Key; Dielectric: X7R; LCSC Part #: C49678; Mounting Type: SMD
D8 = DIO_ZENER_3V: as D7 on sheet SH1 - 48V POWER; Manufacturer Part Number 1: MMSZ4683-TP; Supplier Part Number 1: MMSZ4683-TPMSCT-ND; Supplier 1: Digi-Key; Package/Case: SOD-123
D14 = TVS_DIODE_3.3V_13.3A: as D11 on sheet SH1 - 48V POWER; Mounting Type: SMD; Supplier 1: Digi-Key; Supplier Part Number 1: ESD3V3AP-TPMSCT-ND; Manufacturer Part Number 1: ESD3V3AP-TP
D17 = LED_GREEN: as D6 on sheet SH1 - 48V POWER; Mounting Type: SMD; Supplier 1: Digi-Key; Supplier Part Number 1: 475-1410-1-ND; Supplier 2: Future Electronics; Supplier Part Number 2: 1152237
J12 = CON_2M_TERM: as J10 on sheet SH1 - 48V POWER; Supplier 1: Digi-Key; Supplier Part Number 1: 277-1667-ND; Manufacturer Part Number 1: 1935161; Mounting Type: TH
J19 = CON_4POS_POWERBLADE_FEM: as J9 on sheet SH2 - 5V POWER; Supplier 1: Digi-Key; Mounting Type: TH; Supplier Part Number 1: SAM9721-ND; Manufacturer Part Number 1: MPS-04-7.70-01-L-V
Q2 = PMOS_100V_13A: as Q3 on sheet SH1 - 48V POWER; Mounting Type: SMD; Verified: No; Vdss: 100V; Supplier 1: Digi-Key; Supplier Part Number 1: RD3P130SPFRATLCT-ND; Manufacturer Part Number 1: RD3P130SPFRATL
Q10 = NMOS_60V_340mS: as Q5 on sheet SH1 - 48V POWER; Supplier 1: Digi-Key; Supplier Part Number 1: 4530-2N7002ECT-ND; Mounting Type: SMD; Package/Footprint: SOT-23; Verified: No
R18 = RES_2.7kΩ_0805_1%: as R13 on sheet SH1 - 48V POWER; Supplier 1: Digi-Key; Supplier Part Number 1: P2.70KCCT-ND; Mounting Type: SMD; LCSC Part #: C17530; Package: 0805
R22 = RES_5.6kΩ_0805_5%: RES 5.6K OHM 5% 1/8W 0805; Manufacturer 1: Yageo; Manufacturer Part Number 1: RC0805JR-075K6L; Supplier Part Number 1: 311-5.6KARCT-ND; Supplier 1: Digi-Key; Tolerance: 5%; Package: 0805
R24 = RES_1.2kΩ_0805_5%: RES 1.2K OHM 5% 1/8W 0805; Manufacturer 1: Yageo; Manufacturer Part Number 1: RC0805JR-071K2L; Supplier 1: Digi-Key; Supplier Part Number 1: 311-1.2KARCT-ND; Tolerance: 5%; Package: 0805
R32 = RES_0.015Ω_1206_1%: RES 0.015 OHM 1% 1/2W 1206; Manufacturer 1: Yageo; Manufacturer Part Number 1: CSR1206FK15L0; Supplier Part Number 1: CSR1206FK15L0CT-ND; Supplier 1: Digi-Key
R43 R49 = RES_10kΩ_0805_5%: as R20 on sheet SH1 - 48V POWER; Supplier 1: Digi-Key; Supplier Part Number 1: P10KACT-ND; LCSC Part #: C17414; Mounting Type: SMD
R46 = RES_3.3kΩ_0805_1%: as R2 on sheet SH2 - 5V POWER; Mounting Type: SMD; Supplier 1: Digi-Key; Supplier Part Number 1: 541-3.30KHCT-ND; LCSC Part #: C26010; Package: 0805
R48 = RES_6.04kΩ_0805_1%: as R8 on sheet SH1 - 48V POWER; Mounting Type: SMD; Supplier 1: Digi-Key; Supplier Part Number 1: 311-6.04KCRCT-ND
TP5 = TESTPOINT_LOOP: as TP3 on sheet SH2 - 5V POWER; Supplier Part Number 1: 36-5002-ND; Supplier 1: Digi-Key; Mounting Type: TH
TP_11-TP_13 = TESTPOINT_1MM_CIRCLE: TESTPOINT 1MM CIRCLE
U7 = MPQ8112GJ-AEC1-Z: as U10 on sheet SH1 - 48V POWER; Supplier: Digi-Key; Supplier Part Number: 1589-MPQ8112GJ-AEC1-ZCT-ND; Vmax: 60V; Supplier 1: Digi-Key; Supplier Part Number 1: 1589-MPQ8112GJ-AEC1-ZCT-ND; Manufacturer Part Number: MPQ8112GJ-AEC1-Z

## Sheet SH4 - 3.3V LINEAR REGULATOR.SchDoc: =documentname
size B; CheckedBy: Ari Wasch; Engineer: Logan Hartford; Organization: UW Robotics; Address1: 200 University Avenue; Address2: Waterloo; Address3: Ontario; Address4: Canada N2L 3G6; DocumentNumber: 4; Revision: 6.0; SheetNumber: 4; SheetTotal: 6
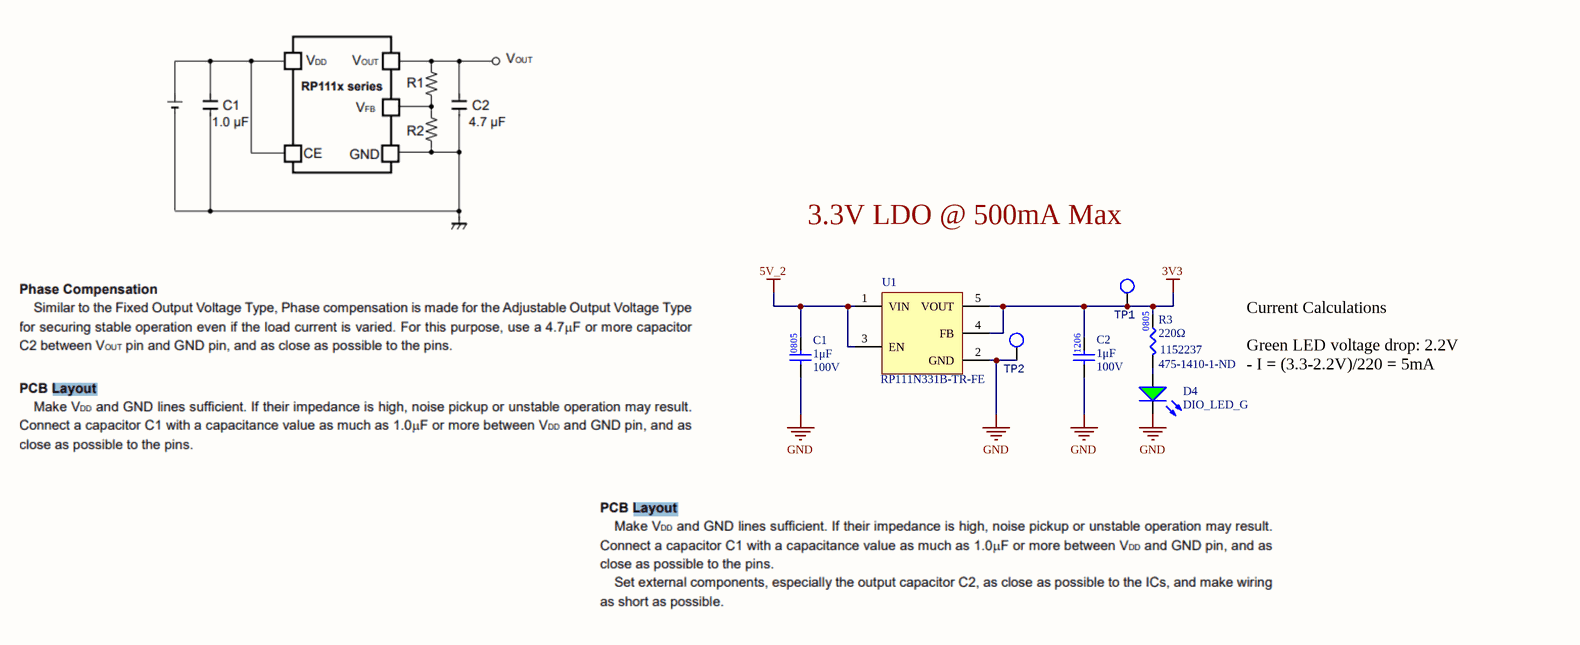
[diagram p3: SH4 - 3.3V LINEAR REGULATOR.SchDoc]

### Parts
C1  value 1μF  Voltage Rating: 100V  [CAP0805]  (hidden comment: CAP_1uF_100V_0805)
C2  value 1μF  Voltage Rating: 100V  [CAPC3216X190X50NL20T25]  (hidden comment: CAP_1uF_100V_1206)
D4  DIO_LED_G  Supplier Part Number 1: 475-1410-1-ND  Supplier Part Number 2: 1152237  [LED_0805_GREEN]
R3  value 220Ω  [RES0805]  (hidden comment: RES_220Ω_0805_5%)
TP1  TESTPOINT_LOOP  [TESTPOINT_LOOP]  (value not drawn)
TP2  TESTPOINT_LOOP  [TESTPOINT_LOOP]  (value not drawn)
U1  Manufacturer Part Number 1: RP111N331B-TR-FE  [SOT23-5]  (hidden comment: LDO_3.3V_500mA)

### Nets
3V3: C2.2 R3.2 TP1.1 U1.4(FB) U1.5(VOUT)
5V_2: C1.2 U1.1(VIN) U1.3(EN)
GND: C1.1 C2.1 D4.2(K) TP2.1 U1.2(GND)
NetD4_1: D4.1(A) R3.1

### Notes on the sheet
- 3.3V LDO @ 500mA Max
- Current Calculations
  Green LED voltage drop: 2.2V
  - I = (3.3-2.2V)/220 = 5mA
- Title:
- Project:
- Date:
- Rev:
- Reviewer:
- Engineer:
- Sheet:
- of

### Library data of the parts
C1 = CAP_1uF_100V_0805: CAP CER 1UF 100V X7S 0805; Supplier 1: Digi-Key; Mounting Type: SMD; Package: 0805; Supplier Part Number 1: 490-14464-1-ND
C2 = CAP_1uF_100V_1206: CAP CER 1UF 100V X7R 1206; Supplier 1: Digi-Key; Mounting Type: SMD; Package: 1206; Supplier Part Number 1: 490-16468-1-ND
D4 = DIO_LED_G: LED GREEN DIFFUSED 0805 SMD; Manufacturer Part Number 1: LG R971-KN-1; Manufacturer 1: OSRAM; Forward Voltage Drop: 2.2V; Package/Footprint: 0805; Mounting Type: SMD; Supplier 1: Digi-Key; Supplier 2: Future Electronics
R3 = RES_220Ω_0805_5%: RES 220 OHM 5% 1/2W 0805; Manufacturer 1: Panasonic Electronic Components; Manufacturer Part Number 1: ERJ-P06J221V; Supplier Part Number 1: P220ADCT-ND; Supplier 1: Digi-Key; LCSC Part #: C17557; Mounting Type: SMD; Package: 0805
TP1 TP2 = TESTPOINT_LOOP: as TP3 on sheet SH2 - 5V POWER; Supplier 1: Digi-Key; Supplier Part Number 1: 36-5002-ND; Mounting Type: TH
U1 = LDO_3.3V_500mA: IC REG LINEAR 3.3V 500MA SOT23-5; Manufacturer 1: RICOH Electronic Devices Co., LTD.; Input Voltage (Max): 5.25V; Voltage Dropout (Max): 0.32V; Package/Footprint: SOT-25; Supplier 1: Digi-Key; Supplier Part Number 1: 2129-RP111N331B-TR-FECT-ND; Output Voltage (Fixed): 3.3V; Output Current: 500mA; Operating Temperature: -40°C - 85°C; Mounting Type: SMD

## Sheet SH5 - MICROCONTROLLER.SchDoc: Microcontroller
size B; CheckedBy: Ari Wasch; Engineer: Logan Hartford; Organization: UW Robotics; Address1: 200 University Avenue; Address2: Waterloo; Address3: Ontario; Address4: Canada N2L 3G6; DocumentNumber: 7; Revision: 6.0; SheetNumber: 5; SheetTotal: 6
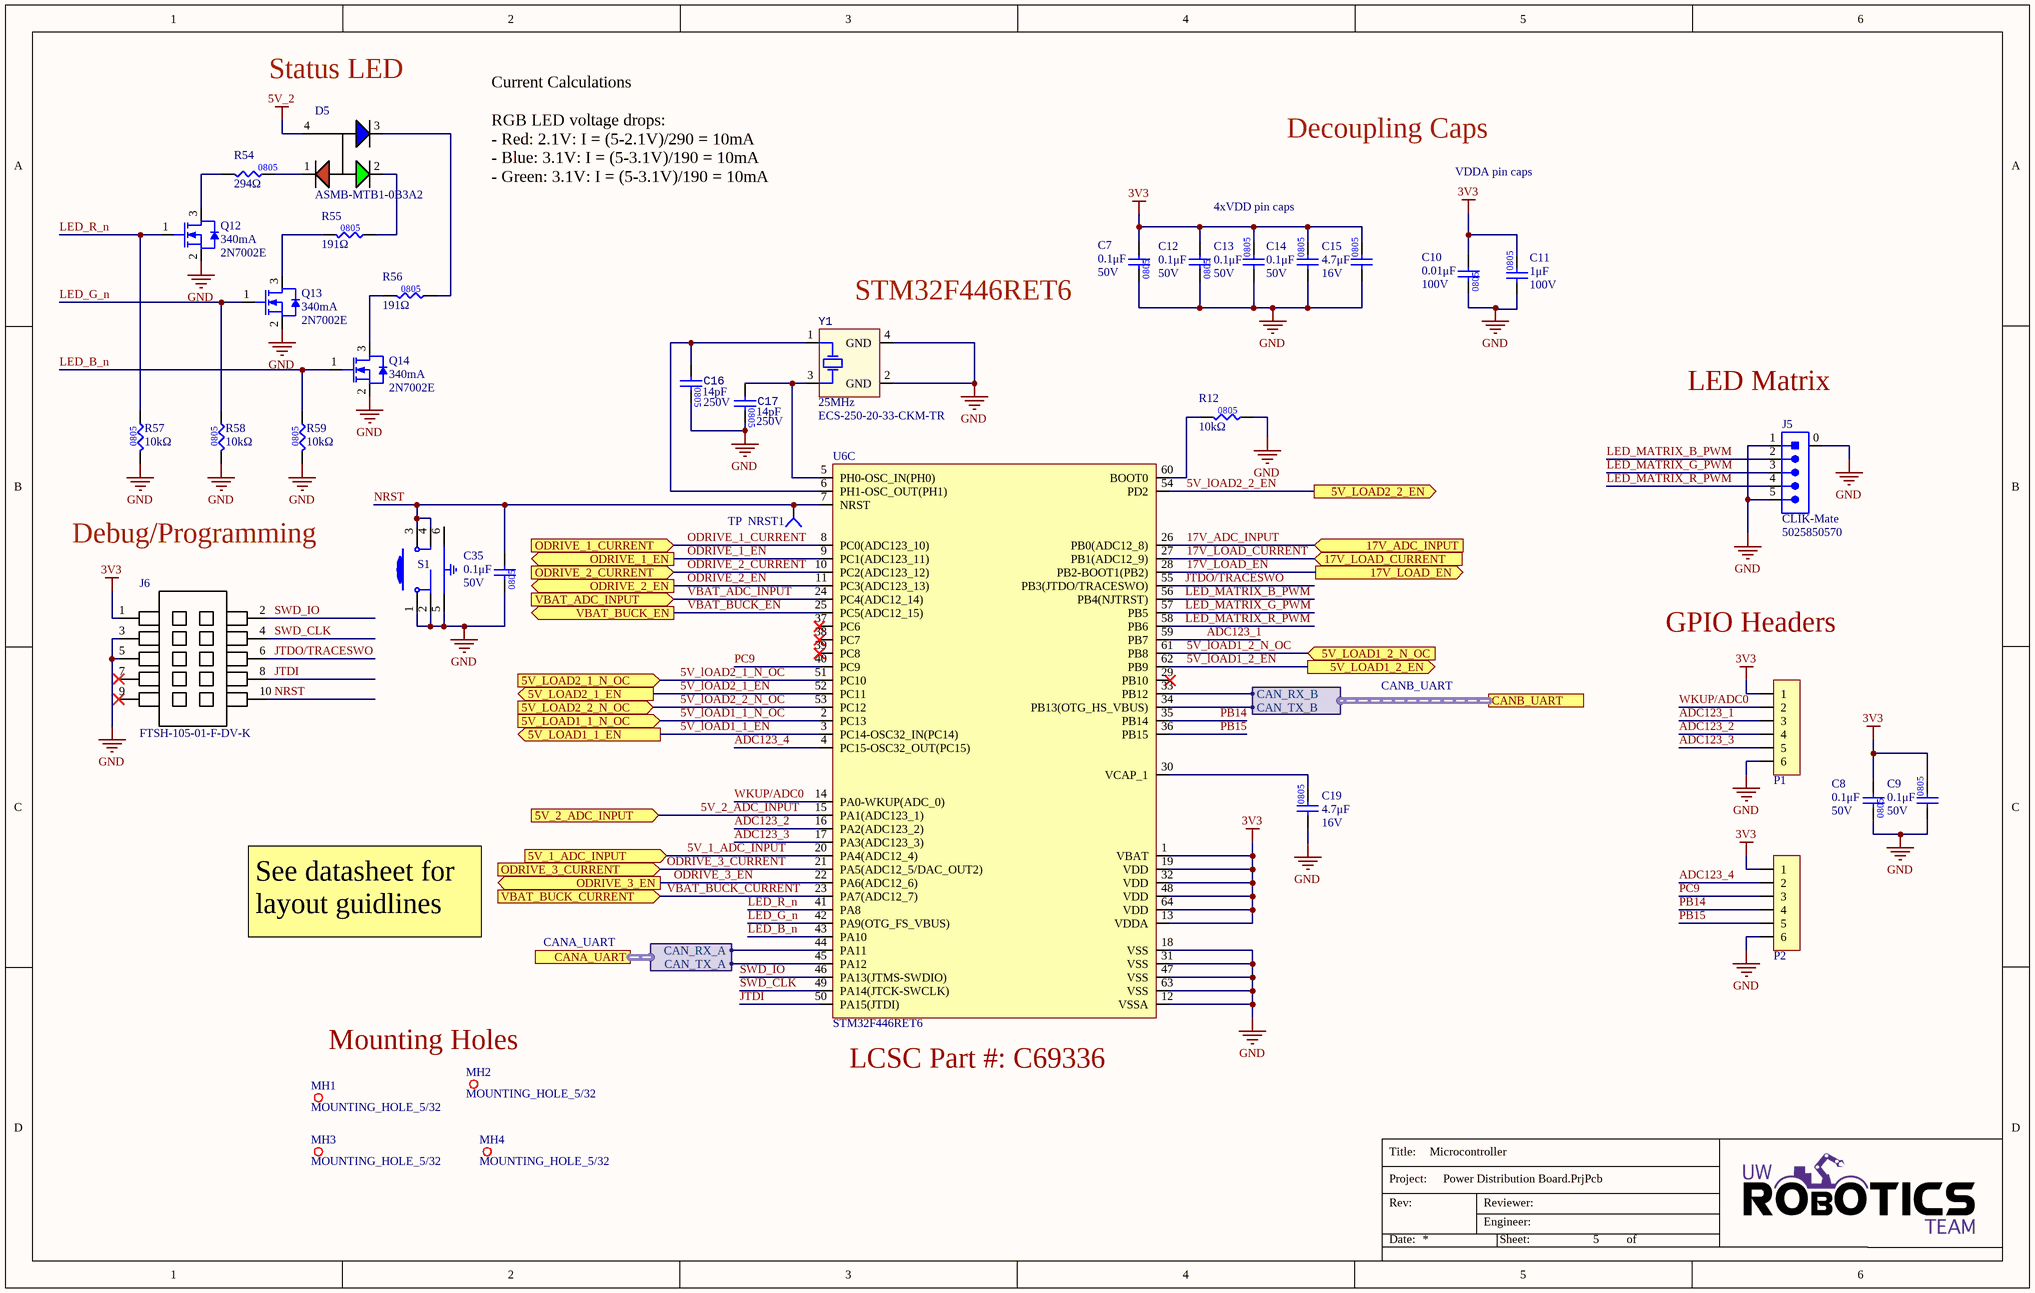
[diagram p4: SH5 - MICROCONTROLLER.SchDoc]

### Parts
C7  value 0.1μF  Voltage Rating: 50V  [CAP2012]  (hidden comment: CAP_0.1uF_50V_0805)
C8  value 0.1μF  Voltage Rating: 50V  [CAP2012]  (hidden comment: CAP_0.1uF_50V_0805)
C9  value 0.1μF  Voltage Rating: 50V  [CAP2012]  (hidden comment: CAP_0.1uF_50V_0805)
C10  value 0.01μF  Voltage Rating: 100V  [CAP0805]  (hidden comment: CAP_0.01uF_100V_0805)
C11  value 1μF  Voltage Rating: 100V  [CAP0805]  (hidden comment: CAP_1uF_100V_0805)
C12  value 0.1μF  Voltage Rating: 50V  [CAP2012]  (hidden comment: CAP_0.1uF_50V_0805)
C13  value 0.1μF  Voltage Rating: 50V  [CAP2012]  (hidden comment: CAP_0.1uF_50V_0805)
C14  value 0.1μF  Voltage Rating: 50V  [CAP2012]  (hidden comment: CAP_0.1uF_50V_0805)
C15  value 4.7μF  Voltage Rating: 16V  [CAP0805]  (hidden comment: CAP_4.7uF_16V_0805)
C16  value 14pF  Voltage Rating: 250V  [CAP0805]  (hidden comment: CAP_14pF_50V_0805)
C17  value 14pF  Voltage Rating: 250V  [CAP0805]  (hidden comment: CAP_14pF_50V_0805)
C19  value 4.7μF  Voltage Rating: 16V  [CAP0805]  (hidden comment: CAP_4.7uF_16V_0805)
C35  value 0.1μF  Voltage Rating: 50V  [CAP2012]  (hidden comment: CAP_0.1uF_50V_0805)
D5  Manufacturer Part Number 1: ASMB-MTB1-0B3A2  [LED_RGB]  (hidden comment: LED_RGB)
J5  Family: CLIK-Mate  Manufacturer Part Number 1: 5025850570  [MOLEX-5025850570]  (hidden comment: CON_5M_SM_RA)
J6  Manufacturer Part Number 1: FTSH-105-01-F-DV-K  [FTSH-105-01-F-DV-K-P-TR]  (hidden comment: CON_PROGRAMMING)
MH1  MOUNTING_HOLE_5/32  [MOUNTING_HOLE_5/38]  (no BOM)
MH2  MOUNTING_HOLE_5/32  [MOUNTING_HOLE_5/38]  (no BOM)
MH3  MOUNTING_HOLE_5/32  [MOUNTING_HOLE_5/38]  (no BOM)
MH4  MOUNTING_HOLE_5/32  [MOUNTING_HOLE_5/38]  (no BOM)
P1  CONN_TERMINAL_6  [CONN_6POS_SIP]  (value not drawn)
P2  CONN_TERMINAL_6  [CONN_6POS_SIP]  (value not drawn)
Q12  Id: 340mA  Manufacturer Part Number 1: 2N7002E  [SOT23-3]  (hidden comment: NMOS_60V_340mS)
Q13  Id: 340mA  Manufacturer Part Number 1: 2N7002E  [SOT23-3]  (hidden comment: NMOS_60V_340mS)
Q14  Id: 340mA  Manufacturer Part Number 1: 2N7002E  [SOT23-3]  (hidden comment: NMOS_60V_340mS)
R12  value 10kΩ  [RES0805]  (hidden comment: RES_10kΩ_0805_5%)
R54  value 294Ω  [RES0805]  (hidden comment: RES_294Ω_0805_1%)
R55  value 191Ω  [RES0805]  (hidden comment: RES_191Ω_0805_1%)
R56  value 191Ω  [RES0805]  (hidden comment: RES_191Ω_0805_1%)
R57  value 10kΩ  [RES0805]  (hidden comment: RES_10kΩ_0805_5%)
R58  value 10kΩ  [RES0805]  (hidden comment: RES_10kΩ_0805_5%)
R59  value 10kΩ  [RES0805]  (hidden comment: RES_10kΩ_0805_5%)
S1  SW_PUSHBUTTON  [TACTILE_SWITCH_SMD]  (value not drawn)
TP_NRST1  TESTPOINT_1MM_CIRCLE  [TESTPOINT_CIRCLE_1MM]  (value not drawn)  (no BOM)
U6  STM32F446RET6  [STM_LQFP64_N]  (part C of 3)
Y1  Frequency: 25MHz  Manufacturer Part Number 1: ECS-250-20-33-CKM-TR  [XTAL_ECS-250-20-33-CKM-TR]  (hidden comment: CRYSTAL_25MHZ_20PF)

### Ports
5V_1_ADC_INPUT (in), 5V_2_ADC_INPUT (in), 5V_LOAD1_1_EN (out), 5V_LOAD1_1_N_OC (in), 5V_LOAD1_2_EN (out), 5V_LOAD1_2_N_OC (in), 5V_LOAD2_1_EN (out), 5V_LOAD2_1_N_OC (in), 5V_LOAD2_2_EN (out), 5V_LOAD2_2_N_OC (in), 17V_ADC_INPUT (in), 17V_LOAD_CURRENT (in), 17V_LOAD_EN (out), CANA_UART (harness CANA_UART), CANB_UART (harness CANB_UART), ODRIVE_1_CURRENT (in), ODRIVE_1_EN (out), ODRIVE_2_CURRENT (in), ODRIVE_2_EN (out), ODRIVE_3_CURRENT (in), ODRIVE_3_EN (out), VBAT_ADC_INPUT (in), VBAT_BUCK_CURRENT (in), VBAT_BUCK_EN (out)

### Harnesses
CANA_UART: CAN_RX_A, CAN_TX_A
CANB_UART: CAN_RX_B, CAN_TX_B

### Nets
3V3: C7.2 C8.2 C9.2 C10.2 C11.2 C12.2 C13.2 C14.2 C15.2 J6.1 P1.1 P2.1 U6.1(VBAT) U6.13(VDDA) U6.19(VDD) U6.32(VDD) U6.48(VDD) U6.64(VDD)
5V_2: D5.4(COMMON_ANODE)
GND: C7.1 C8.1 C9.1 C10.1 C11.1 C12.1 C13.1 C14.1 C15.1 C16.2 C17.2 C19.1 C35.1 J5.0 J5.1 J5.5 J6.3 J6.5 P1.6 P2.6 Q12.2(Source) Q13.2(Source) Q14.2(Source) R12.1 R57.2 R58.2 R59.2 S1.1 S1.2 S1.5 U6.12(VSSA) U6.18(VSS) U6.31(VSS) U6.47(VSS) U6.63(VSS) Y1.2(GND) Y1.4(GND)
5V_1_ADC_INPUT: U6.20(PA4(ADC12_4)) ; port 5V_1_ADC_INPUT
5V_2_ADC_INPUT: U6.15(PA1(ADC123_1)) ; port 5V_2_ADC_INPUT
5V_lOAD1_1_EN: U6.3(PC14-OSC32_IN(PC14)) ; port 5V_LOAD1_1_EN
5V_lOAD1_1_N_OC: U6.2(PC13) ; port 5V_LOAD1_1_N_OC
5V_lOAD1_2_EN: U6.62(PB9) ; port 5V_LOAD1_2_EN
5V_lOAD1_2_N_OC: U6.61(PB8) ; port 5V_LOAD1_2_N_OC
5V_lOAD2_1_EN: U6.52(PC11) ; port 5V_LOAD2_1_EN
5V_lOAD2_1_N_OC: U6.51(PC10) ; port 5V_LOAD2_1_N_OC
5V_lOAD2_2_EN: U6.54(PD2) ; port 5V_LOAD2_2_EN
5V_lOAD2_2_N_OC: U6.53(PC12) ; port 5V_LOAD2_2_N_OC
17V_ADC_INPUT: U6.26(PB0(ADC12_8)) ; port 17V_ADC_INPUT
17V_LOAD_CURRENT: U6.27(PB1(ADC12_9)) ; port 17V_LOAD_CURRENT
17V_LOAD_EN: U6.28(PB2-BOOT1(PB2)) ; port 17V_LOAD_EN
ADC123_1: P1.3 U6.59(PB7)
ADC123_2: P1.4 U6.16(PA2(ADC123_2))
ADC123_3: P1.5 U6.17(PA3(ADC123_3))
ADC123_4: P2.2 U6.4(PC15-OSC32_OUT(PC15))
JTDI: J6.8 U6.50(PA15(JTDI))
JTDO/TRACESWO: J6.6 U6.55(PB3(JTDO/TRACESWO))
LED_B_n: Q14.1(Gate) R59.1 U6.43(PA10)
LED_G_n: Q13.1(Gate) R58.1 U6.42(PA9(OTG_FS_VBUS))
LED_MATRIX_B_PWM: J5.2 U6.56(PB4(NJTRST))
LED_MATRIX_G_PWM: J5.3 U6.57(PB5)
LED_MATRIX_R_PWM: J5.4 U6.58(PB6)
LED_R_n: Q12.1(Gate) R57.1 U6.41(PA8)
NRST: C35.2 J6.10 S1.3 S1.4 TP_NRST1.1(=value) U6.7(NRST)
ODRIVE_1_CURRENT: U6.8(PC0(ADC123_10)) ; port ODRIVE_1_CURRENT
ODRIVE_1_EN: U6.9(PC1(ADC123_11)) ; port ODRIVE_1_EN
ODRIVE_2_CURRENT: U6.10(PC2(ADC123_12)) ; port ODRIVE_2_CURRENT
ODRIVE_2_EN: U6.11(PC3(ADC123_13)) ; port ODRIVE_2_EN
ODRIVE_3_CURRENT: U6.21(PA5(ADC12_5/DAC_OUT2)) ; port ODRIVE_3_CURRENT
ODRIVE_3_EN: U6.22(PA6(ADC12_6)) ; port ODRIVE_3_EN
PB14: P2.4 U6.35(PB14)
PB15: P2.5 U6.36(PB15)
PC9: P2.3 U6.40(PC9)
SWD_CLK: J6.4 U6.49(PA14(JTCK-SWCLK))
SWD_IO: J6.2 U6.46(PA13(JTMS-SWDIO))
VBAT_ADC_INPUT: U6.24(PC4(ADC12_14)) ; port VBAT_ADC_INPUT
VBAT_BUCK_CURRENT: U6.23(PA7(ADC12_7)) ; port VBAT_BUCK_CURRENT
VBAT_BUCK_EN: U6.25(PC5(ADC12_15)) ; port VBAT_BUCK_EN
WKUP/ADC0: P1.2 U6.14(PA0-WKUP(ADC_0))
NetC16_1: C16.1 U6.6(PH1-OSC_OUT(PH1)) Y1.1(HOT)
NetC17_1: C17.1 U6.5(PH0-OSC_IN(PH0)) Y1.3(HOT)
NetC19_2: C19.2 U6.30(VCAP_1)
NetD5_1: D5.1(CATHODE_(RED)) R54.2
NetD5_2: D5.2(CATHODE_(GREEN)) R55.1
NetD5_3: D5.3(CATHODE_(BLUE)) R56.1
NetQ12_3: Q12.3(Drain) R54.1
NetQ13_3: Q13.3(Drain) R55.2
NetQ14_3: Q14.3(Drain) R56.2
NetR12_2: R12.2 U6.60(BOOT0)
NetU6_33: U6.33(PB12) ; port CANB_UART.CAN_RX_B
NetU6_34: U6.34(PB13(OTG_HS_VBUS)) ; port CANB_UART.CAN_TX_B
NetU6_44: U6.44(PA11) ; port CANA_UART.CAN_RX_A
NetU6_45: U6.45(PA12) ; port CANA_UART.CAN_TX_A

Not connected (* = marked no-connect by the designer): J6 7* 9*; S1 6; U6 29(PB10)* 37(PC6)* 38(PC7)* 39(PC8)*

### Notes on the sheet
- (near D5) Status LED
- Decoupling Caps
- Current Calculations
  RGB LED voltage drops:
  - Red: 2.1V: I = (5-2.1V)/290 = 10mA
  - Blue: 3.1V: I = (5-3.1V)/190 = 10mA
  - Green: 3.1V: I = (5-3.1V)/190 = 10mA
- 4xVDD pin caps
- VDDA pin caps
- (near Y1) STM32F446RET6
- (near J5) LED Matrix
- Debug/Programming
- GPIO Headers
- See datasheet for layout guidlines
- Mounting Holes
- (near U6) LCSC Part #: C69336
- Title:
- Project:
- Date:
- Rev:
- Reviewer:
- Engineer:
- Sheet:
- of

### Library data of the parts
C7-C9 C12-C14 C35 = CAP_0.1uF_50V_0805: as C21 on sheet SH1 - 48V POWER; Supplier Part Number 1: 490-8049-1-ND; Supplier 1: Digi-Key; Dielectric: X7R; LCSC Part #: C49678; Mounting Type: SMD
C10 = CAP_0.01uF_100V_0805: CAP CER 0.01uF 100V X7R 0805; Manufacturer Part Number 1: 08051C103KAT2A; Manufacturer 1: AVX Corporation; Supplier Part Number 1: 478-1358-1-ND; Supplier 1: Digi-Key; Dielectric: X7R; LCSC Part #: C1710; Mounting Type: SMD; Package: 0805
C11 = CAP_1uF_100V_0805: CAP CER 1UF 100V X7S 0805; Supplier 1: Digi-Key; Mounting Type: SMD; Package: 0805; Supplier Part Number 1: 490-14464-1-ND
C15 C19 = CAP_4.7uF_16V_0805: CAP CER 4.7UF 16V X5R 0805; Manufacturer Part Number 1: CL21A475KOFNNNE; Manufacturer 1: Samsung Electro-Mechanics; Supplier Part Number 1: 1276-1065-1-ND; Supplier 1: Digi-Key; Dielectric: X5R; LCSC Part #: C1779; Mounting Type: SMD; Package: 0805
C16 C17 = CAP_14pF_50V_0805: CERAMIC CAP MLCC HIGH-Q 125C; Manufacturer: Murata Electronics; Manufacturer Part Number: GQM2195C2E140JB12D; Mounting Type: SMD; Package: 0805; Supplier 1: Digi-Key; Supplier Part Number 1: 490-GQM2195C2E140JB12DCT-ND
D5 = LED_RGB: LED RGB DIFFUSED 4PLCC SMD; Manufacturer 1: Broadcom; Color: Blue,Green,Red; Lens Color: White; Viewing Angle: 115°; Lens Style: Round; Luminous Intensity: 350mcd; Dominant Wavelength: 470nm; Forward Voltage: 3.1V; Test Current: 20mA; Package/Footprint: 4-PLCC; Supplier 1: Digi-Key; Number of Pins: 4; Lens Transparency: Diffused; Supplier Part Number 1: 516-ASMB-MTB1-0B3A2CT-ND; Mounting Type: SMD
J5 = CON_5M_SM_RA: CONN HEADER SMD RIGHT ANGLE 1.5MM PITCH; Manufacturer 1: Molex; Current Rating: 2A; Supplier 1: Digi-Key; Supplier Part Number 1: WM14469CT-ND; Orientation: Right Angle; Mounting Type: SMD; Package/Footprint: SMD
J6 = CON_PROGRAMMING: CONN HEADER SMD 10POS 1.27MM; Manufacturer 1: Samtec; Supplier 1: Digi-Key; Pitch: 1.27mm; Supplier Part Number 1: SAM8796-ND; Mounting Type: SMD
P1 P2 = CONN_SIP_6: Header, 6-Pin, SIP
Q12-Q14 = NMOS_60V_340mS: as Q5 on sheet SH1 - 48V POWER; Supplier 1: Digi-Key; Supplier Part Number 1: 4530-2N7002ECT-ND; Mounting Type: SMD; Package/Footprint: SOT-23; Verified: No
R12 R57-R59 = RES_10kΩ_0805_5%: as R20 on sheet SH1 - 48V POWER; Supplier Part Number 1: P10KACT-ND; Supplier 1: Digi-Key; LCSC Part #: C17414; Mounting Type: SMD
R54 = RES_294Ω_0805_1%: RES 402 OHM 1% 1/8W 0805; Manufacturer 1: Rohm Semiconductor; Manufacturer Part Number 1: MCR10ERTF2940; Package/Footprint: 0805; Supplier 1: Digi-Key; Supplier Part Number 1: RHM294CHCT-ND; Mounting Type: SMD
R55 R56 = RES_191Ω_0805_1%: RES 402 OHM 1% 1/8W 0805; Manufacturer 1: YAGEO; Manufacturer Part Number 1: RC0805FR-07191RL; Package/Footprint: 0805; Supplier 1: Digi-Key; Supplier Part Number 1: 311-191CRCT-ND; Mounting Type: SMD
S1 = SW_PUSHBUTTON: SMT 3.0 X 2.6 MM TACT SWITCH WIT; Manufacturer Part Number 1: 435151014824; Manufacturer 1: Würth Elektronik; Supplier 1: Digi-Key; Supplier Part Number 1: 732-435151014824CT-ND
TP_NRST1 = TESTPOINT_1MM_CIRCLE: TESTPOINT 1MM CIRCLE
U6 = STM32F446RET6: IC MCU 32BIT 512KB FLASH 64LQFP; Manufacturer 1: STMicroelectronics; Manufacturer Part Number 1: LF80CDT-TR; Supplier 1: Digi-Key; Supplier Part Number 1: 497-15376-ND
Y1 = CRYSTAL_25MHZ_20PF: CRYSTAL 25.0000MHZ 20PF SMD; Manufacturer 1: ECS Inc.; Load Capacitance: 20pF; Supplier 1: Digi-Key; Supplier Part Number 1: XC1817CT-ND; Mounting Type: SMD; Package/Footprint: SMD

## Nets that join several sheets
3V3: SH1 - 48V POWER (R50.2 R51.2 R52.2 R53.2), SH2 - 5V POWER (R4.2 R5.2 R6.2 R7.2), SH3 - 17V POWER (R49.2), SH4 - 3.3V LINEAR REGULATOR (5 pins), SH5 - MICROCONTROLLER (18 pins)
5V_2: SH1 - 48V POWER (8 pins), SH2 - 5V POWER (12 pins), SH3 - 17V POWER (C33.2 U7.6), SH4 - 3.3V LINEAR REGULATOR (C1.2 U1.1 U1.3), SH5 - MICROCONTROLLER (D5.4)
GND: SH1 - 48V POWER (30 pins), SH2 - 5V POWER (34 pins), SH3 - 17V POWER (11 pins), SH4 - 3.3V LINEAR REGULATOR (5 pins), SH5 - MICROCONTROLLER (37 pins)
VBAT_FUSED: SH1 - 48V POWER (20 pins), SH2 - 5V POWER (J9.1 J16.1), SH3 - 17V POWER (J19.1)
5V_1_ADC_INPUT: SH2 - 5V POWER (5 pins), SH5 - MICROCONTROLLER (U6.20)
5V_2_ADC_INPUT: SH2 - 5V POWER (5 pins), SH5 - MICROCONTROLLER (U6.15)
5V_lOAD1_1_EN: SH2 - 5V POWER (R34.2 TP_1.1 U2.4), SH5 - MICROCONTROLLER (U6.3)
5V_lOAD1_1_N_OC: SH2 - 5V POWER (R4.1 TP_5.1 U2.5), SH5 - MICROCONTROLLER (U6.2)
5V_lOAD1_2_EN: SH2 - 5V POWER (R38.2 TP_2.1 U3.4), SH5 - MICROCONTROLLER (U6.62)
5V_lOAD1_2_N_OC: SH2 - 5V POWER (R5.1 TP_6.1 U3.5), SH5 - MICROCONTROLLER (U6.61)
5V_lOAD2_1_EN: SH2 - 5V POWER (R36.2 TP_3.1 U4.4), SH5 - MICROCONTROLLER (U6.52)
5V_lOAD2_1_N_OC: SH2 - 5V POWER (R6.1 TP_7.1 U4.5), SH5 - MICROCONTROLLER (U6.51)
5V_lOAD2_2_EN: SH2 - 5V POWER (R37.2 TP_4.1 U5.4), SH5 - MICROCONTROLLER (U6.54)
5V_lOAD2_2_N_OC: SH2 - 5V POWER (R7.1 TP_10.1 U5.5), SH5 - MICROCONTROLLER (U6.53)
17V_ADC_INPUT: SH3 - 17V POWER (5 pins), SH5 - MICROCONTROLLER (U6.26)
17V_LOAD_CURRENT: SH3 - 17V POWER (D8.1 R48.2 TP_13.1), SH5 - MICROCONTROLLER (U6.27)
17V_LOAD_EN: SH3 - 17V POWER (Q10.1 R49.1 TP_11.1), SH5 - MICROCONTROLLER (U6.28)
ODRIVE_1_CURRENT: SH1 - 48V POWER (D7.1 R8.2 TP_15.1), SH5 - MICROCONTROLLER (U6.8)
ODRIVE_1_EN: SH1 - 48V POWER (Q7.1 R50.1 TP_14.1), SH5 - MICROCONTROLLER (U6.9)
ODRIVE_2_CURRENT: SH1 - 48V POWER (D10.1 R9.2 TP_17.1), SH5 - MICROCONTROLLER (U6.10)
ODRIVE_2_EN: SH1 - 48V POWER (Q8.1 R51.1 TP_16.1), SH5 - MICROCONTROLLER (U6.11)
ODRIVE_3_CURRENT: SH1 - 48V POWER (D13.1 R47.2 TP_22.1), SH5 - MICROCONTROLLER (U6.21)
ODRIVE_3_EN: SH1 - 48V POWER (Q9.1 R53.1 TP_21.1), SH5 - MICROCONTROLLER (U6.22)
VBAT_ADC_INPUT: SH1 - 48V POWER (5 pins), SH5 - MICROCONTROLLER (U6.24)
VBAT_BUCK_CURRENT: SH1 - 48V POWER (D12.1 R10.2 TP_20.1), SH5 - MICROCONTROLLER (U6.23)
VBAT_BUCK_EN: SH1 - 48V POWER (Q5.1 R52.1 TP_18.1), SH5 - MICROCONTROLLER (U6.25)

## Assembly variants
Only Populated Components: not fitted R28 R31 R44 R47 R60 R77